# Altium project ZynqPi.PrjPcb (part 1 of 2)
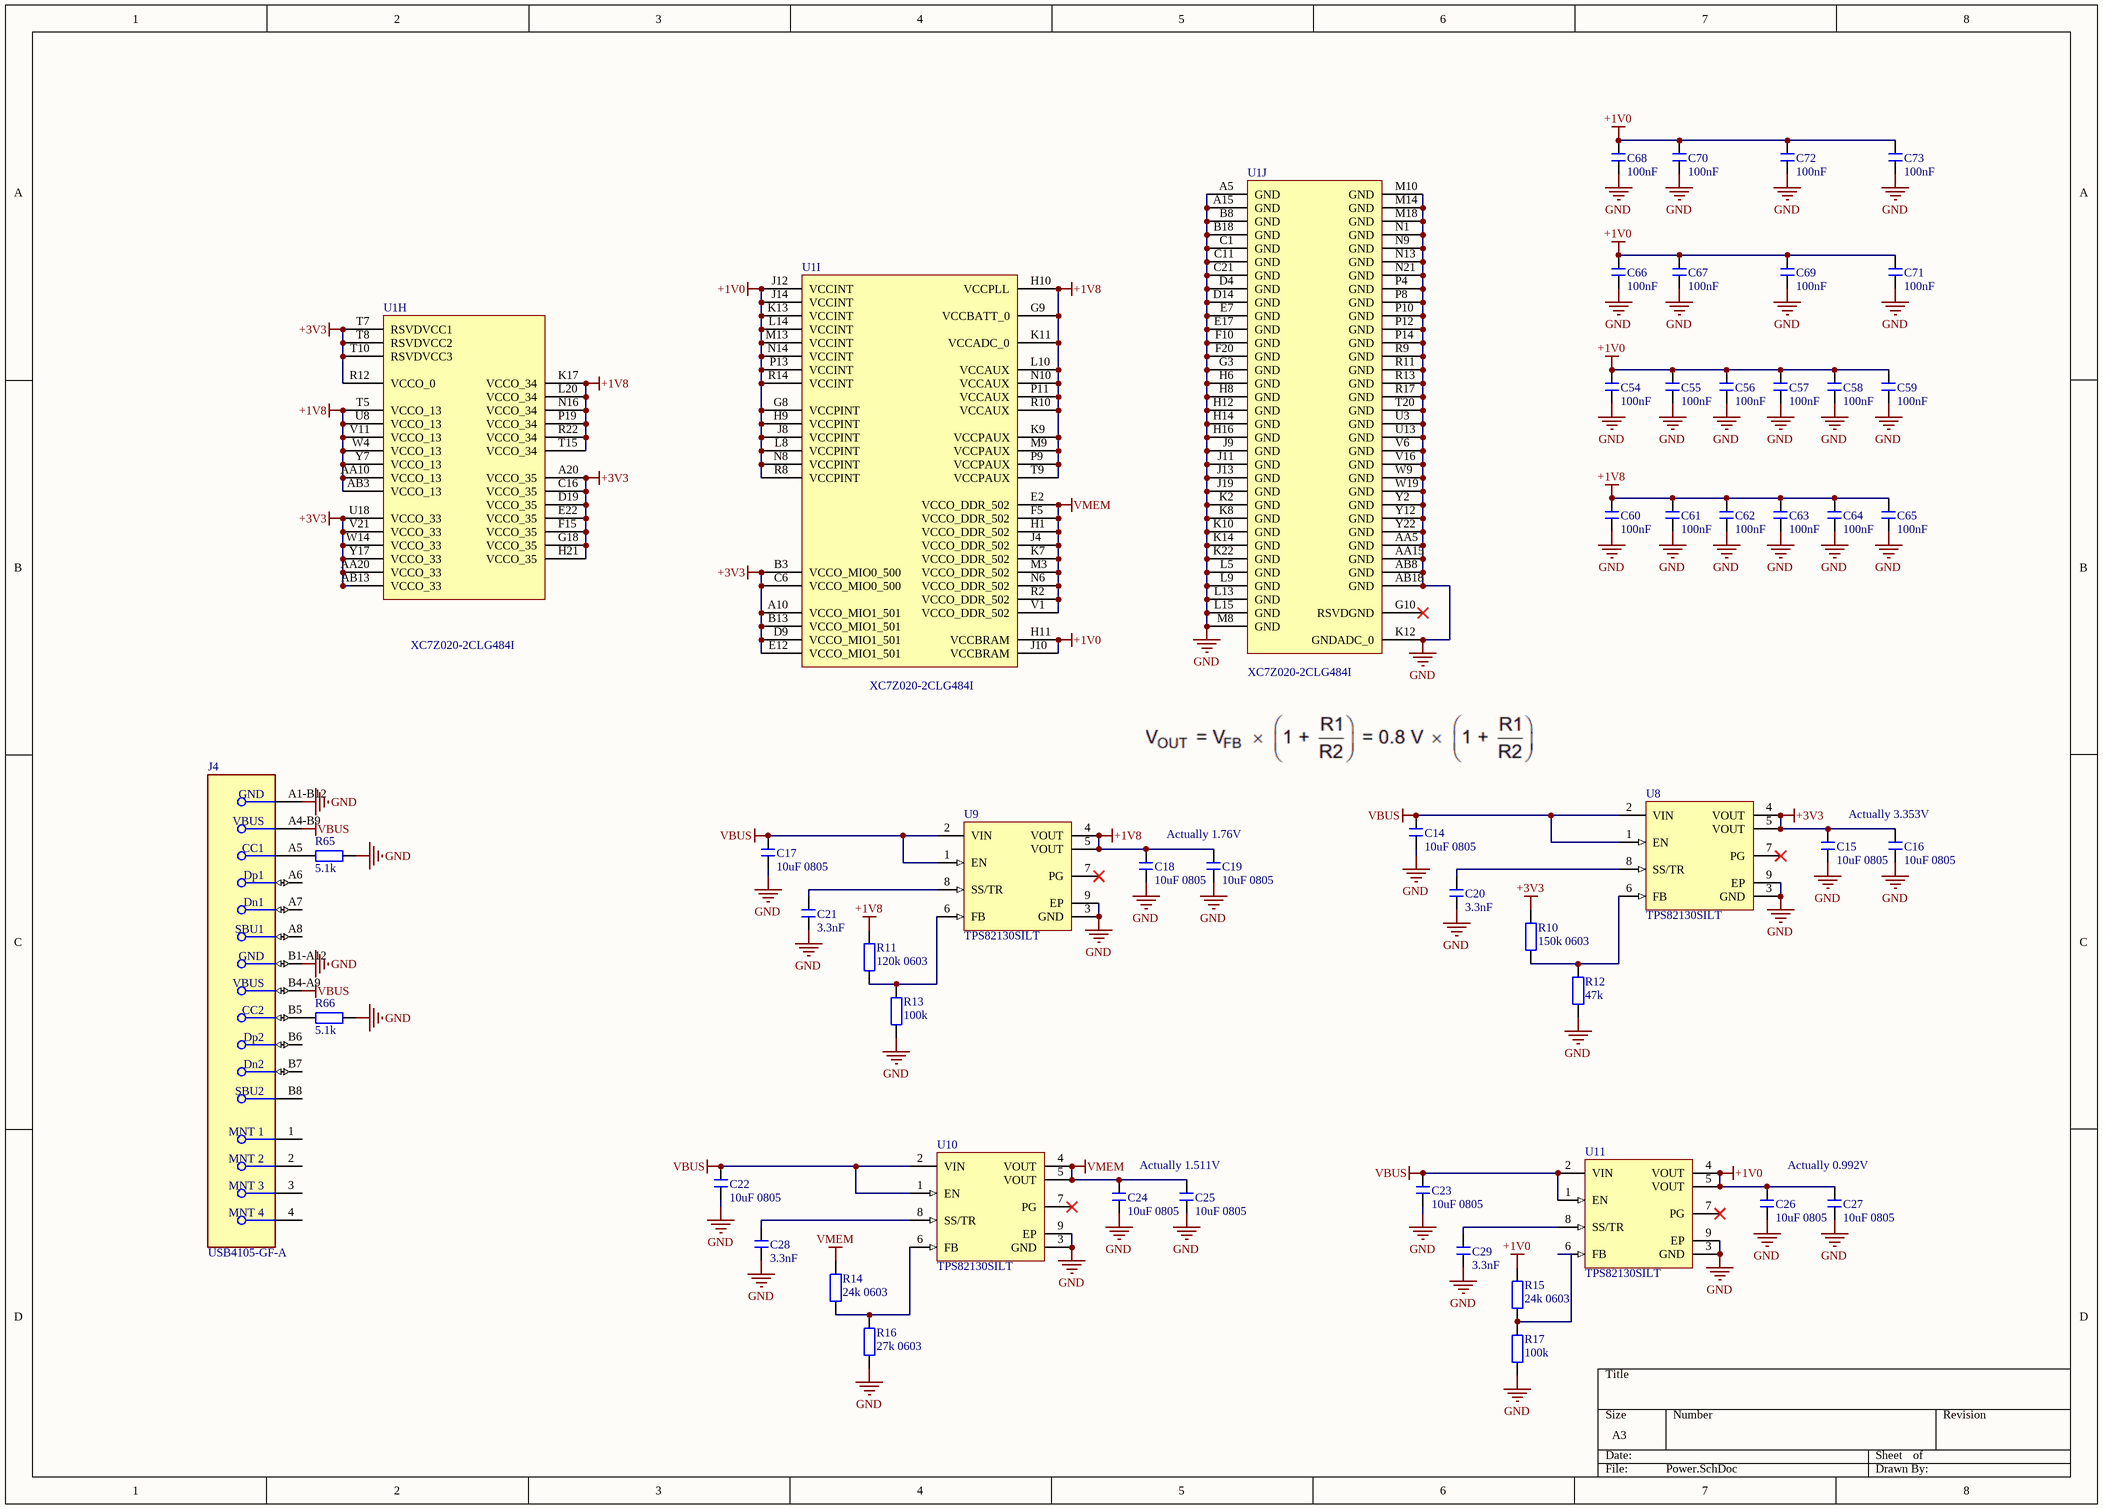
[diagram p0: Power.SchDoc]
9 sheets, 170 parts. Net scope: global (net labels, ports and power ports of the same name join across sheets).
Board file: PCB1.PcbDoc
Sheets:
  Sheet1.SchDoc
  Power.SchDoc
  DDR.SchDoc
  MIO.SchDoc
  Bank13.SchDoc
  Bank33.SchDoc
  Bank34.SchDoc
  Bank35.SchDoc
  Miscellaneous.SchDoc

## Sheet Sheet1.SchDoc
size A3; SheetNumber: 1; SheetTotal: 9

## Sheet Power.SchDoc
size A3; SheetNumber: 2; SheetTotal: 9

### Parts
C14  10uF 0805  [C0603]
C15  10uF 0805  [C0603]
C16  10uF 0805  [C0603]
C17  10uF 0805  [C0603]
C18  10uF 0805  [C0603]
C19  10uF 0805  [C0603]
C20  3.3nF  [C0402]
C21  3.3nF  [C0402]
C22  10uF 0805  [C0603]
C23  10uF 0805  [C0603]
C24  10uF 0805  [C0603]
C25  10uF 0805  [C0603]
C26  10uF 0805  [C0603]
C27  10uF 0805  [C0603]
C28  3.3nF  [C0402]
C29  3.3nF  [C0402]
C54  100nF  [C0402]
C55  100nF  [C0402]
C56  100nF  [C0402]
C57  100nF  [C0402]
C58  100nF  [C0402]
C59  100nF  [C0402]
C60  100nF  [C0402]
C61  100nF  [C0402]
C62  100nF  [C0402]
C63  100nF  [C0402]
C64  100nF  [C0402]
C65  100nF  [C0402]
C66  100nF  [C0402]
C67  100nF  [C0402]
C68  100nF  [C0402]
C69  100nF  [C0402]
C70  100nF  [C0402]
C71  100nF  [C0402]
C72  100nF  [C0402]
C73  100nF  [C0402]
J4  USB4105-GF-A  [FP-USB4105-GF-A-MFG]
R10  150k 0603  [R0603]
R11  120k 0603  [R0603]
R12  47k  [R0402]
R13  100k  [R0402]
R14  24k 0603  [R0603]
R15  24k 0603  [R0603]
R16  27k 0603  [R0603]
R17  100k  [R0402]
R65  5.1k  [R0402]
R66  5.1k  [R0402]
U1  XC7Z020-2CLG484I  [CLG484]  (parts H,I,J of 10)
U8  TPS82130SILT  [SIL0008D_V]
U9  TPS82130SILT  [SIL0008D_V]
U10  TPS82130SILT  [SIL0008D_V]
U11  TPS82130SILT  [SIL0008D_V]

### Nets
+1V0: C26.2 C27.2 C54.2 C55.2 C56.2 C57.2 C58.2 C59.2 C66.2 C67.2 C68.2 C69.2 C70.2 C71.2 C72.2 C73.2 R15.1 U1.G8(VCCPINT) U1.H9(VCCPINT) U1.H11(VCCBRAM) U1.J8(VCCPINT) U1.J10(VCCBRAM) U1.J12(VCCINT) U1.J14(VCCINT) U1.K13(VCCINT) U1.L8(VCCPINT) U1.L14(VCCINT) U1.M13(VCCINT) U1.N8(VCCPINT) U1.N14(VCCINT) U1.P13(VCCINT) U1.R8(VCCPINT) U1.R14(VCCINT) U11.4(VOUT) U11.5(VOUT)
+1V8: C18.2 C19.2 C60.2 C61.2 C62.2 C63.2 C64.2 C65.2 R11.1 U1.AA10(VCCO_13) U1.AB3(VCCO_13) U1.G9(VCCBATT_0) U1.H10(VCCPLL) U1.K9(VCCPAUX) U1.K11(VCCADC_0) U1.K17(VCCO_34) U1.L10(VCCAUX) U1.L20(VCCO_34) U1.M9(VCCPAUX) U1.N10(VCCAUX) U1.N16(VCCO_34) U1.P9(VCCPAUX) U1.P11(VCCAUX) U1.P19(VCCO_34) U1.R10(VCCAUX) U1.R22(VCCO_34) U1.T5(VCCO_13) U1.T9(VCCPAUX) U1.T15(VCCO_34) U1.U8(VCCO_13) U1.V11(VCCO_13) U1.W4(VCCO_13) U1.Y7(VCCO_13) U9.4(VOUT) U9.5(VOUT)
+3V3: C15.2 C16.2 R10.1 U1.A10(VCCO_MIO1_501) U1.A20(VCCO_35) U1.AA20(VCCO_33) U1.AB13(VCCO_33) U1.B3(VCCO_MIO0_500) U1.B13(VCCO_MIO1_501) U1.C6(VCCO_MIO0_500) U1.C16(VCCO_35) U1.D9(VCCO_MIO1_501) U1.D19(VCCO_35) U1.E12(VCCO_MIO1_501) U1.E22(VCCO_35) U1.F15(VCCO_35) U1.G18(VCCO_35) U1.H21(VCCO_35) U1.R12(VCCO_0) U1.T7(RSVDVCC1) U1.T8(RSVDVCC2) U1.T10(RSVDVCC3) U1.U18(VCCO_33) U1.V21(VCCO_33) U1.W14(VCCO_33) U1.Y17(VCCO_33) U8.4(VOUT) U8.5(VOUT)
GND: C14.1 C15.1 C16.1 C17.1 C18.1 C19.1 C20.1 C21.1 C22.1 C23.1 C24.1 C25.1 C26.1 C27.1 C28.1 C29.1 C54.1 C55.1 C56.1 C57.1 C58.1 C59.1 C60.1 C61.1 C62.1 C63.1 C64.1 C65.1 C66.1 C67.1 C68.1 C69.1 C70.1 C71.1 C72.1 C73.1 J4.A1-B12(GND) J4.B1-A12(GND) R12.2 R13.2 R16.2 R17.2 R65.2 R66.2 U1.A5(GND) U1.A15(GND) U1.AA5(GND) U1.AA15(GND) U1.AB8(GND) U1.AB18(GND) U1.B8(GND) U1.B18(GND) U1.C1(GND) U1.C11(GND) U1.C21(GND) U1.D4(GND) U1.D14(GND) U1.E7(GND) U1.E17(GND) U1.F10(GND) U1.F20(GND) U1.G3(GND) U1.H6(GND) U1.H8(GND) U1.H12(GND) U1.H14(GND) U1.H16(GND) U1.J9(GND) U1.J11(GND) U1.J13(GND) U1.J19(GND) U1.K2(GND) U1.K8(GND) U1.K10(GND) U1.K12(GNDADC_0) U1.K14(GND) U1.K22(GND) U1.L5(GND) U1.L9(GND) U1.L13(GND) U1.L15(GND) U1.M8(GND) U1.M10(GND) U1.M14(GND) U1.M18(GND) U1.N1(GND) U1.N9(GND) U1.N13(GND) U1.N21(GND) U1.P4(GND) U1.P8(GND) U1.P10(GND) U1.P12(GND) U1.P14(GND) U1.R9(GND) U1.R11(GND) U1.R13(GND) U1.R17(GND) U1.T20(GND) U1.U3(GND) U1.U13(GND) U1.V6(GND) U1.V16(GND) U1.W9(GND) U1.W19(GND) U1.Y2(GND) U1.Y12(GND) U1.Y22(GND) U8.3(GND) U8.9(EP) U9.3(GND) U9.9(EP) U10.3(GND) U10.9(EP) U11.3(GND) U11.9(EP)
VBUS: C14.2 C17.2 C22.2 C23.2 J4.A4-B9(VBUS) J4.B4-A9(VBUS) U8.1(EN) U8.2(VIN) U9.1(EN) U9.2(VIN) U10.1(EN) U10.2(VIN) U11.1(EN) U11.2(VIN)
VMEM: C24.2 C25.2 R14.1 U1.E2(VCCO_DDR_502) U1.F5(VCCO_DDR_502) U1.H1(VCCO_DDR_502) U1.J4(VCCO_DDR_502) U1.K7(VCCO_DDR_502) U1.M3(VCCO_DDR_502) U1.N6(VCCO_DDR_502) U1.R2(VCCO_DDR_502) U1.V1(VCCO_DDR_502) U10.4(VOUT) U10.5(VOUT)
NetC20_2: C20.2 U8.8(SS/TR)
NetC21_2: C21.2 U9.8(SS/TR)
NetC28_2: C28.2 U10.8(SS/TR)
NetC29_2: C29.2 U11.8(SS/TR)
NetJ4_A5: J4.A5(CC1) R65.1
NetJ4_B5: J4.B5(CC2) R66.1
NetR10_2: R10.2 R12.1 U8.6(FB)
NetR11_2: R11.2 R13.1 U9.6(FB)
NetR14_2: R14.2 R16.1 U10.6(FB)
NetR15_2: R15.2 R17.1 U11.6(FB)

Not connected (* = marked no-connect by the designer): J4 1(MNT_1) 2(MNT_2) 3(MNT_3) 4(MNT_4) A6(Dp1) A7(Dn1) A8(SBU1) B6(Dp2) B7(Dn2) B8(SBU2); U1 G10(RSVDGND)*; U8 7(PG)*; U9 7(PG)*; U10 7(PG)*; U11 7(PG)*

### Notes on the sheet
- Actually 1.76V
- Actually 3.353V
- Actually 1.511V
- Actually 0.992V

### Library data of the parts
C14-C29 C54-C73 = C
J4 = CMP-245163-000001-1: CONN RCPT USB2.0 TYPEC 5A; Manufacturer: GCT; Voltage Rating: 20V; Is Female: yes; Current Rating: 5/6.25/1.25/0.25A; Number Of Contacts: 16; Conn Orientation: Right Angle; Device Class L1: Connectors; Category: Conn; Lead Free: Yes; RoHS: TRUE; Temperature Range High: +85°C; Digikey Description: CONN RCPT USB2.0 TYPEC 5A; Device Class L3: unset; ComponentLink2Description: Datasheet; Manufacturer Part Number: USB4105-GF-A; Package: 0; Usb Standard: USB 2.0; Device Class L2: USB Connectors; Automotive: No; Temperature Range Low: -40°C; Height: 3.46mm; Temperature: -40°C to +85°C; Contact Material: Gold,Nickel; ComponentLink2URL: https://gct.co/files/drawings/usb4105.pdf; Octopart: https://octopart.com/usb4105-gf-a-gct-106627878
R10-R17 R65 R66 = R
U1 = CMP-0363-00013-3: 733 MHz Zynq™-7000 AP SoC, 130 PS I/O, 200 FPGA I/O, 484-Ball BGA, Speed Grade 2, Industrial Grade, Pb-Free; Speed Grade: -2; Flip Flops: 106400; LUTs: 53200; Extensible Block RAM (# 36Kb Blocks): 560 KB (140); ComponentLink3URL: http://www.xilinx.com/support/documentation/data_sheets/ds187-XC7Z010-XC7Z020-Data-Sheet.pdf; PackageReference: CLG484; Code_JEDEC: MO-275-PPAA-2; ComponentLink2URL: http://www.xilinx.com/support/documentation/user_guides/ug865-Zynq-7000-Pkg-Pinout.pdf; ComponentLink2Description: Package Specification; ComponentLink6URL: http://www.xilinx.com/support/documentation/user_guides/ug483_7Series_PCB.pdf; PackageVersion: Rev 1.1, 09/2012; DatasheetVersion: v1.2; PartNumber: XC7Z020-2CLG484I; ComponentLink3Description: DC and AC Switching Characteristics; PackageDescription: Wire-Bond Chip-Scale BGA, Body 19 x 19 mm, 0.8 mm Pitch; RoHS: Pb-Free; ComponentLink5URL: http://www.xilinx.com/support/documentation/user_guides/ug865-Zynq-7000-Pkg-Pinout.pdf; ComponentLink1URL: http://www.xilinx.com/support/documentation/data_sheets/ds190-Zynq-7000-Overview.pdf; ComponentLink4Description: Package File; Generic Part Number: XC7Z020; Mounting Technology: Surface Mount; ComponentLink1Description: Datasheet; ComponentLink4URL: http://www.xilinx.com/support/packagefiles/z7packages/xc7z020clg484pkg.txt; ComponentLink6Description: PCB and Layout Guide; ComponentLink5Description: Packaging and Pinout
U8-U11 = CMP-2000-07569-1: Step-Down Converter MicroSiP(TM) Module with Integrated Inductor, 3 A, 3 to 17 V, -40 to 125 degC, 8-Pin uSiP (SIL), Tape and Reel; Manufacturer: Texas Instruments; Quiescent Current: 20uA; Output Voltage: 5V; Output Current: 3A; Max Input Voltage: 17V; Switching Frequency: 2MHz; Min Output Voltage: 900mV; Number of Outputs: 1; Min Input Voltage: 3V; Datasheet URL: http://www.ti.com/lit/ds/symlink/tps82130.pdf; Packaging: CutTape; Datasheet Version: Rev. C, 01/2017; Package Reference: SIL0008D; Case/Package: SMD/SMT; Manufacturer URL: http://www.ti.com/; Length: 0.12inch; Lead Free: LeadFree; Mount: SurfaceMount; Number of Pins: 8; Package Description: 8-Pin Single In-line Package, Body 3 x 2.8 mm, Pitch 0.65 mm; Max Output Voltage: 5V; Mounting Technology: SurfaceMount; Height: 0.06inch; Max Operating Temperature: 125degC; Width: 0.11inch; Min Operating Temperature: -40degC; Voltage - Output 1: 5V; RoHSCompliant: True; REACH SVHC: NoSVHC; Max Output Current: 3A

## Sheet DDR.SchDoc
size A3; SheetNumber: 3; SheetTotal: 9
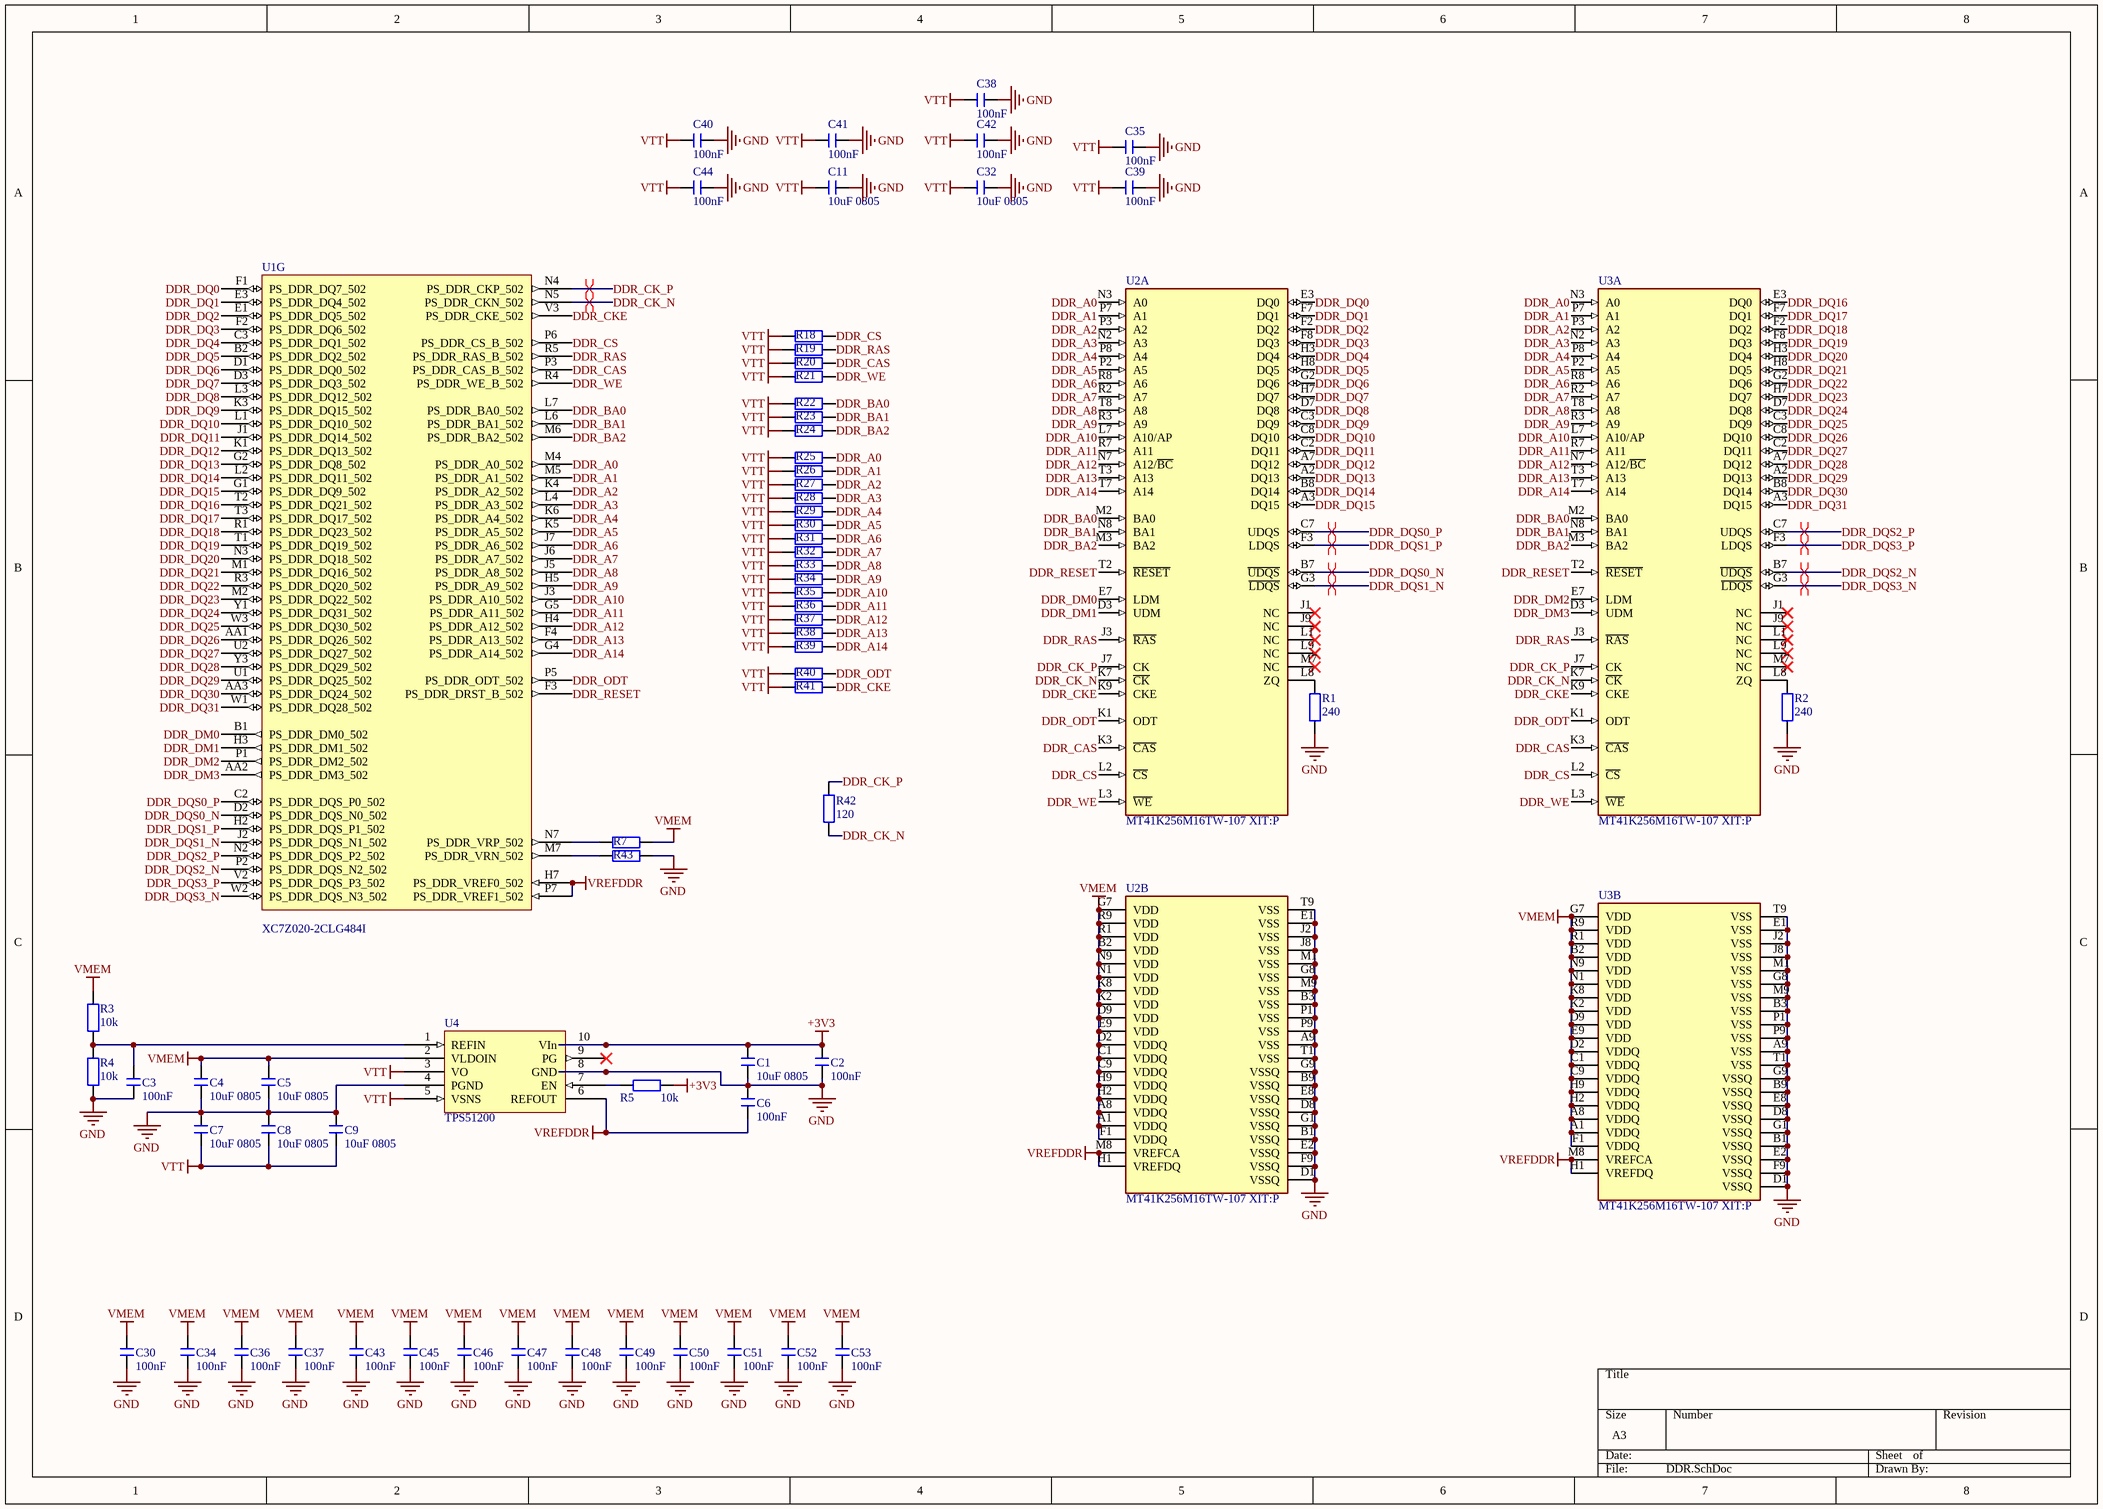
[diagram p1: DDR.SchDoc]

### Parts
C1  10uF 0805  [C0603]
C2  100nF  [C0402]
C3  100nF  [C0402]
C4  10uF 0805  [C0603]
C5  10uF 0805  [C0603]
C6  100nF  [C0402]
C7  10uF 0805  [C0603]
C8  10uF 0805  [C0603]
C9  10uF 0805  [C0603]
C11  10uF 0805  [C0603]
C30  100nF  [C0402]
C32  10uF 0805  [C0603]
C34  100nF  [C0402]
C35  100nF  [C0402]
C36  100nF  [C0402]
C37  100nF  [C0402]
C38  100nF  [C0402]
C39  100nF  [C0402]
C40  100nF  [C0402]
C41  100nF  [C0402]
C42  100nF  [C0402]
C43  100nF  [C0402]
C44  100nF  [C0402]
C45  100nF  [C0402]
C46  100nF  [C0402]
C47  100nF  [C0402]
C48  100nF  [C0402]
C49  100nF  [C0402]
C50  100nF  [C0402]
C51  100nF  [C0402]
C52  100nF  [C0402]
C53  100nF  [C0402]
R1  240  [R0402]
R2  240  [R0402]
R3  10k  [R0402]
R4  10k  [R0402]
R5  10k  [R0402]
R7  49.9  [R0402]  (value not drawn)
R18  49.9  [R0402]  (value not drawn)
R19  49.9  [R0402]  (value not drawn)
R20  49.9  [R0402]  (value not drawn)
R21  49.9  [R0402]  (value not drawn)
R22  49.9  [R0402]  (value not drawn)
R23  49.9  [R0402]  (value not drawn)
R24  49.9  [R0402]  (value not drawn)
R25  49.9  [R0402]  (value not drawn)
R26  49.9  [R0402]  (value not drawn)
R27  49.9  [R0402]  (value not drawn)
R28  49.9  [R0402]  (value not drawn)
R29  49.9  [R0402]  (value not drawn)
R30  49.9  [R0402]  (value not drawn)
R31  49.9  [R0402]  (value not drawn)
R32  49.9  [R0402]  (value not drawn)
R33  49.9  [R0402]  (value not drawn)
R34  49.9  [R0402]  (value not drawn)
R35  49.9  [R0402]  (value not drawn)
R36  49.9  [R0402]  (value not drawn)
R37  49.9  [R0402]  (value not drawn)
R38  49.9  [R0402]  (value not drawn)
R39  49.9  [R0402]  (value not drawn)
R40  49.9  [R0402]  (value not drawn)
R41  49.9  [R0402]  (value not drawn)
R42  120  [R0402]
R43  49.9  [R0402]  (value not drawn)
U1  XC7Z020-2CLG484I  [CLG484]  (part G of 10)
U2  MT41K256M16TW-107 XIT:P  [FP-TW-MFG]  (parts A,B of 2)
U3  MT41K256M16TW-107 XIT:P  [FP-TW-MFG]  (parts A,B of 2)
U4  TPS51200  [SON50P300X100_HS-11N]

### Nets
+3V3: C1.2 C2.2 R5.2 U4.10(VIn)
GND: C1.1 C2.1 C3.1 C4.1 C5.1 C6.2 C7.2 C8.2 C9.2 C11.1 C30.1 C32.1 C34.1 C35.1 C36.1 C37.1 C38.1 C39.1 C40.1 C41.1 C42.1 C43.1 C44.1 C45.1 C46.1 C47.1 C48.1 C49.1 C50.1 C51.1 C52.1 C53.1 R1.2 R2.2 R4.2 R43.2 U2.A9(VSS) U2.B1(VSSQ) U2.B3(VSS) U2.B9(VSSQ) U2.D1(VSSQ) U2.D8(VSSQ) U2.E1(VSS) U2.E2(VSSQ) U2.E8(VSSQ) U2.F9(VSSQ) U2.G1(VSSQ) U2.G8(VSS) U2.G9(VSSQ) U2.J2(VSS) U2.J8(VSS) U2.M1(VSS) U2.M9(VSS) U2.P1(VSS) U2.P9(VSS) U2.T1(VSS) U2.T9(VSS) U3.A9(VSS) U3.B1(VSSQ) U3.B3(VSS) U3.B9(VSSQ) U3.D1(VSSQ) U3.D8(VSSQ) U3.E1(VSS) U3.E2(VSSQ) U3.E8(VSSQ) U3.F9(VSSQ) U3.G1(VSSQ) U3.G8(VSS) U3.G9(VSSQ) U3.J2(VSS) U3.J8(VSS) U3.M1(VSS) U3.M9(VSS) U3.P1(VSS) U3.P9(VSS) U3.T1(VSS) U3.T9(VSS) U4.4(PGND) U4.8(GND)
VMEM: C4.2 C5.2 C30.2 C34.2 C36.2 C37.2 C43.2 C45.2 C46.2 C47.2 C48.2 C49.2 C50.2 C51.2 C52.2 C53.2 R3.1 R7.2 U2.A1(VDDQ) U2.A8(VDDQ) U2.B2(VDD) U2.C1(VDDQ) U2.C9(VDDQ) U2.D2(VDDQ) U2.D9(VDD) U2.E9(VDD) U2.F1(VDDQ) U2.G7(VDD) U2.H2(VDDQ) U2.H9(VDDQ) U2.K2(VDD) U2.K8(VDD) U2.N1(VDD) U2.N9(VDD) U2.R1(VDD) U2.R9(VDD) U3.A1(VDDQ) U3.A8(VDDQ) U3.B2(VDD) U3.C1(VDDQ) U3.C9(VDDQ) U3.D2(VDDQ) U3.D9(VDD) U3.E9(VDD) U3.F1(VDDQ) U3.G7(VDD) U3.H2(VDDQ) U3.H9(VDDQ) U3.K2(VDD) U3.K8(VDD) U3.N1(VDD) U3.N9(VDD) U3.R1(VDD) U3.R9(VDD) U4.2(VLDOIN)
VREFDDR: C6.1 U1.H7(PS_DDR_VREF0_502) U1.P7(PS_DDR_VREF1_502) U2.H1(VREFDQ) U2.M8(VREFCA) U3.H1(VREFDQ) U3.M8(VREFCA) U4.6(REFOUT)
VTT: C7.1 C8.1 C9.1 C11.2 C32.2 C35.2 C38.2 C39.2 C40.2 C41.2 C42.2 C44.2 R18.1 R19.1 R20.1 R21.1 R22.1 R23.1 R24.1 R25.1 R26.1 R27.1 R28.1 R29.1 R30.1 R31.1 R32.1 R33.1 R34.1 R35.1 R36.1 R37.1 R38.1 R39.1 R40.1 R41.1 U4.3(VO) U4.5(VSNS)
DDR_A0: R25.2 U1.M4(PS_DDR_A0_502) U2.N3(A0) U3.N3(A0)
DDR_A1: R26.2 U1.M5(PS_DDR_A1_502) U2.P7(A1) U3.P7(A1)
DDR_A2: R27.2 U1.K4(PS_DDR_A2_502) U2.P3(A2) U3.P3(A2)
DDR_A3: R28.2 U1.L4(PS_DDR_A3_502) U2.N2(A3) U3.N2(A3)
DDR_A4: R29.2 U1.K6(PS_DDR_A4_502) U2.P8(A4) U3.P8(A4)
DDR_A5: R30.2 U1.K5(PS_DDR_A5_502) U2.P2(A5) U3.P2(A5)
DDR_A6: R31.2 U1.J7(PS_DDR_A6_502) U2.R8(A6) U3.R8(A6)
DDR_A7: R32.2 U1.J6(PS_DDR_A7_502) U2.R2(A7) U3.R2(A7)
DDR_A8: R33.2 U1.J5(PS_DDR_A8_502) U2.T8(A8) U3.T8(A8)
DDR_A9: R34.2 U1.H5(PS_DDR_A9_502) U2.R3(A9) U3.R3(A9)
DDR_A10: R35.2 U1.J3(PS_DDR_A10_502) U2.L7(A10/AP) U3.L7(A10/AP)
DDR_A11: R36.2 U1.G5(PS_DDR_A11_502) U2.R7(A11) U3.R7(A11)
DDR_A12: R37.2 U1.H4(PS_DDR_A12_502) U2.N7(A12/~{BC}) U3.N7(A12/~{BC})
DDR_A13: R38.2 U1.F4(PS_DDR_A13_502) U2.T3(A13) U3.T3(A13)
DDR_A14: R39.2 U1.G4(PS_DDR_A14_502) U2.T7(A14) U3.T7(A14)
DDR_BA0: R22.2 U1.L7(PS_DDR_BA0_502) U2.M2(BA0) U3.M2(BA0)
DDR_BA1: R23.2 U1.L6(PS_DDR_BA1_502) U2.N8(BA1) U3.N8(BA1)
DDR_BA2: R24.2 U1.M6(PS_DDR_BA2_502) U2.M3(BA2) U3.M3(BA2)
DDR_CAS: R20.2 U1.P3(PS_DDR_CAS_B_502) U2.K3(~{CAS}) U3.K3(~{CAS})
DDR_CK_N: R42.1 U1.N5(PS_DDR_CKN_502) U2.K7(~{CK}) U3.K7(~{CK})
DDR_CK_P: R42.2 U1.N4(PS_DDR_CKP_502) U2.J7(CK) U3.J7(CK)
DDR_CKE: R41.2 U1.V3(PS_DDR_CKE_502) U2.K9(CKE) U3.K9(CKE)
DDR_CS: R18.2 U1.P6(PS_DDR_CS_B_502) U2.L2(~{CS}) U3.L2(~{CS})
DDR_DM0: U1.B1(PS_DDR_DM0_502) U2.E7(LDM)
DDR_DM1: U1.H3(PS_DDR_DM1_502) U2.D3(UDM)
DDR_DM2: U1.P1(PS_DDR_DM2_502) U3.E7(LDM)
DDR_DM3: U1.AA2(PS_DDR_DM3_502) U3.D3(UDM)
DDR_DQ0: U1.F1(PS_DDR_DQ7_502) U2.E3(DQ0)
DDR_DQ1: U1.E3(PS_DDR_DQ4_502) U2.F7(DQ1)
DDR_DQ2: U1.E1(PS_DDR_DQ5_502) U2.F2(DQ2)
DDR_DQ3: U1.F2(PS_DDR_DQ6_502) U2.F8(DQ3)
DDR_DQ4: U1.C3(PS_DDR_DQ1_502) U2.H3(DQ4)
DDR_DQ5: U1.B2(PS_DDR_DQ2_502) U2.H8(DQ5)
DDR_DQ6: U1.D1(PS_DDR_DQ0_502) U2.G2(DQ6)
DDR_DQ7: U1.D3(PS_DDR_DQ3_502) U2.H7(DQ7)
DDR_DQ8: U1.L3(PS_DDR_DQ12_502) U2.D7(DQ8)
DDR_DQ9: U1.K3(PS_DDR_DQ15_502) U2.C3(DQ9)
DDR_DQ10: U1.L1(PS_DDR_DQ10_502) U2.C8(DQ10)
DDR_DQ11: U1.J1(PS_DDR_DQ14_502) U2.C2(DQ11)
DDR_DQ12: U1.K1(PS_DDR_DQ13_502) U2.A7(DQ12)
DDR_DQ13: U1.G2(PS_DDR_DQ8_502) U2.A2(DQ13)
DDR_DQ14: U1.L2(PS_DDR_DQ11_502) U2.B8(DQ14)
DDR_DQ15: U1.G1(PS_DDR_DQ9_502) U2.A3(DQ15)
DDR_DQ16: U1.T2(PS_DDR_DQ21_502) U3.E3(DQ0)
DDR_DQ17: U1.T3(PS_DDR_DQ17_502) U3.F7(DQ1)
DDR_DQ18: U1.R1(PS_DDR_DQ23_502) U3.F2(DQ2)
DDR_DQ19: U1.T1(PS_DDR_DQ19_502) U3.F8(DQ3)
DDR_DQ20: U1.N3(PS_DDR_DQ18_502) U3.H3(DQ4)
DDR_DQ21: U1.M1(PS_DDR_DQ16_502) U3.H8(DQ5)
DDR_DQ22: U1.R3(PS_DDR_DQ20_502) U3.G2(DQ6)
DDR_DQ23: U1.M2(PS_DDR_DQ22_502) U3.H7(DQ7)
DDR_DQ24: U1.Y1(PS_DDR_DQ31_502) U3.D7(DQ8)
DDR_DQ25: U1.W3(PS_DDR_DQ30_502) U3.C3(DQ9)
DDR_DQ26: U1.AA1(PS_DDR_DQ26_502) U3.C8(DQ10)
DDR_DQ27: U1.U2(PS_DDR_DQ27_502) U3.C2(DQ11)
DDR_DQ28: U1.Y3(PS_DDR_DQ29_502) U3.A7(DQ12)
DDR_DQ29: U1.U1(PS_DDR_DQ25_502) U3.A2(DQ13)
DDR_DQ30: U1.AA3(PS_DDR_DQ24_502) U3.B8(DQ14)
DDR_DQ31: U1.W1(PS_DDR_DQ28_502) U3.A3(DQ15)
DDR_DQS0_N: U1.D2(PS_DDR_DQS_N0_502) U2.B7(~{UDQS})
DDR_DQS0_P: U1.C2(PS_DDR_DQS_P0_502) U2.C7(UDQS)
DDR_DQS1_N: U1.J2(PS_DDR_DQS_N1_502) U2.G3(~{LDQS})
DDR_DQS1_P: U1.H2(PS_DDR_DQS_P1_502) U2.F3(LDQS)
DDR_DQS2_N: U1.P2(PS_DDR_DQS_N2_502) U3.B7(~{UDQS})
DDR_DQS2_P: U1.N2(PS_DDR_DQS_P2_502) U3.C7(UDQS)
DDR_DQS3_N: U1.W2(PS_DDR_DQS_N3_502) U3.G3(~{LDQS})
DDR_DQS3_P: U1.V2(PS_DDR_DQS_P3_502) U3.F3(LDQS)
DDR_ODT: R40.2 U1.P5(PS_DDR_ODT_502) U2.K1(ODT) U3.K1(ODT)
DDR_RAS: R19.2 U1.R5(PS_DDR_RAS_B_502) U2.J3(~{RAS}) U3.J3(~{RAS})
DDR_RESET: U1.F3(PS_DDR_DRST_B_502) U2.T2(~{RESET}) U3.T2(~{RESET})
DDR_WE: R21.2 U1.R4(PS_DDR_WE_B_502) U2.L3(~{WE}) U3.L3(~{WE})
NetC3_2: C3.2 R3.2 R4.1 U4.1(REFIN)
NetR1_1: R1.1 U2.L8(ZQ)
NetR2_1: R2.1 U3.L8(ZQ)
NetR5_1: R5.1 U4.7(EN)
NetR7_1: R7.1 U1.N7(PS_DDR_VRP_502)
NetR43_1: R43.1 U1.M7(PS_DDR_VRN_502)

Not connected (* = marked no-connect by the designer): U2 J1(NC)* J9(NC)* L1(NC)* L9(NC)* M7(NC)*; U3 J1(NC)* J9(NC)* L1(NC)* L9(NC)* M7(NC)*; U4 9(PG)*

### Layout directives
differential pair: DDR_CK_N, DDR_CK_P, DDR_DQS0_N, DDR_DQS0_P, DDR_DQS1_N, DDR_DQS1_P, DDR_DQS2_N, DDR_DQS2_P, DDR_DQS3_N, DDR_DQS3_P

### Library data of the parts
C1-C9 C11 C30 C32 C34-C53 = C
R1-R5 R7 R18-R43 = R
U1 = CMP-0363-00013-3: 733 MHz Zynq™-7000 AP SoC, 130 PS I/O, 200 FPGA I/O, 484-Ball BGA, Speed Grade 2, Industrial Grade, Pb-Free; Speed Grade: -2; Flip Flops: 106400; LUTs: 53200; Extensible Block RAM (# 36Kb Blocks): 560 KB (140); Rule: UNIONINDEX=0|RULEKIND=SignalStimulus|NETSCOPE=AnyNet|LAYERKIND=SameLayer|NAME=Schematic Signal Stimulus|KIND=2|LEVEL=0|STARTTIME=1.000m|STOPTIME=9.000m|PERIODTIME=10.00m|UNIT=Imperial; Rule: UNIONINDEX=0|RULEKIND=SupplyNets|NETSCOPE=AnyNet|LAYERKIND=SameLayer|NAME=Schematic Supply Nets|VOLTAGE=1.500|UNIT=Imperial; ComponentLink3URL: http://www.xilinx.com/support/documentation/data_sheets/ds187-XC7Z010-XC7Z020-Data-Sheet.pdf; PackageReference: CLG484; Code_JEDEC: MO-275-PPAA-2; ComponentLink2URL: http://www.xilinx.com/support/documentation/user_guides/ug865-Zynq-7000-Pkg-Pinout.pdf; ComponentLink2Description: Package Specification; ComponentLink6URL: http://www.xilinx.com/support/documentation/user_guides/ug483_7Series_PCB.pdf; PackageVersion: Rev 1.1, 09/2012; DatasheetVersion: v1.2; PartNumber: XC7Z020-2CLG484I; ComponentLink3Description: DC and AC Switching Characteristics; PackageDescription: Wire-Bond Chip-Scale BGA, Body 19 x 19 mm, 0.8 mm Pitch; RoHS: Pb-Free; ComponentLink5URL: http://www.xilinx.com/support/documentation/user_guides/ug865-Zynq-7000-Pkg-Pinout.pdf; ComponentLink1URL: http://www.xilinx.com/support/documentation/data_sheets/ds190-Zynq-7000-Overview.pdf; ComponentLink4Description: Package File; Generic Part Number: XC7Z020; Mounting Technology: Surface Mount; ComponentLink1Description: Datasheet; ComponentLink4URL: http://www.xilinx.com/support/packagefiles/z7packages/xc7z020clg484pkg.txt; ComponentLink6Description: PCB and Layout Guide; ComponentLink5Description: Packaging and Pinout
U2 U3 = CMP-2000-07474-2: IC DRAM 4GBIT PARALLEL 96FBGA
U4 = TPS51200: Sink and Source DDR Termination Regulator

## Sheet MIO.SchDoc
size A3; SheetNumber: 4; SheetTotal: 9
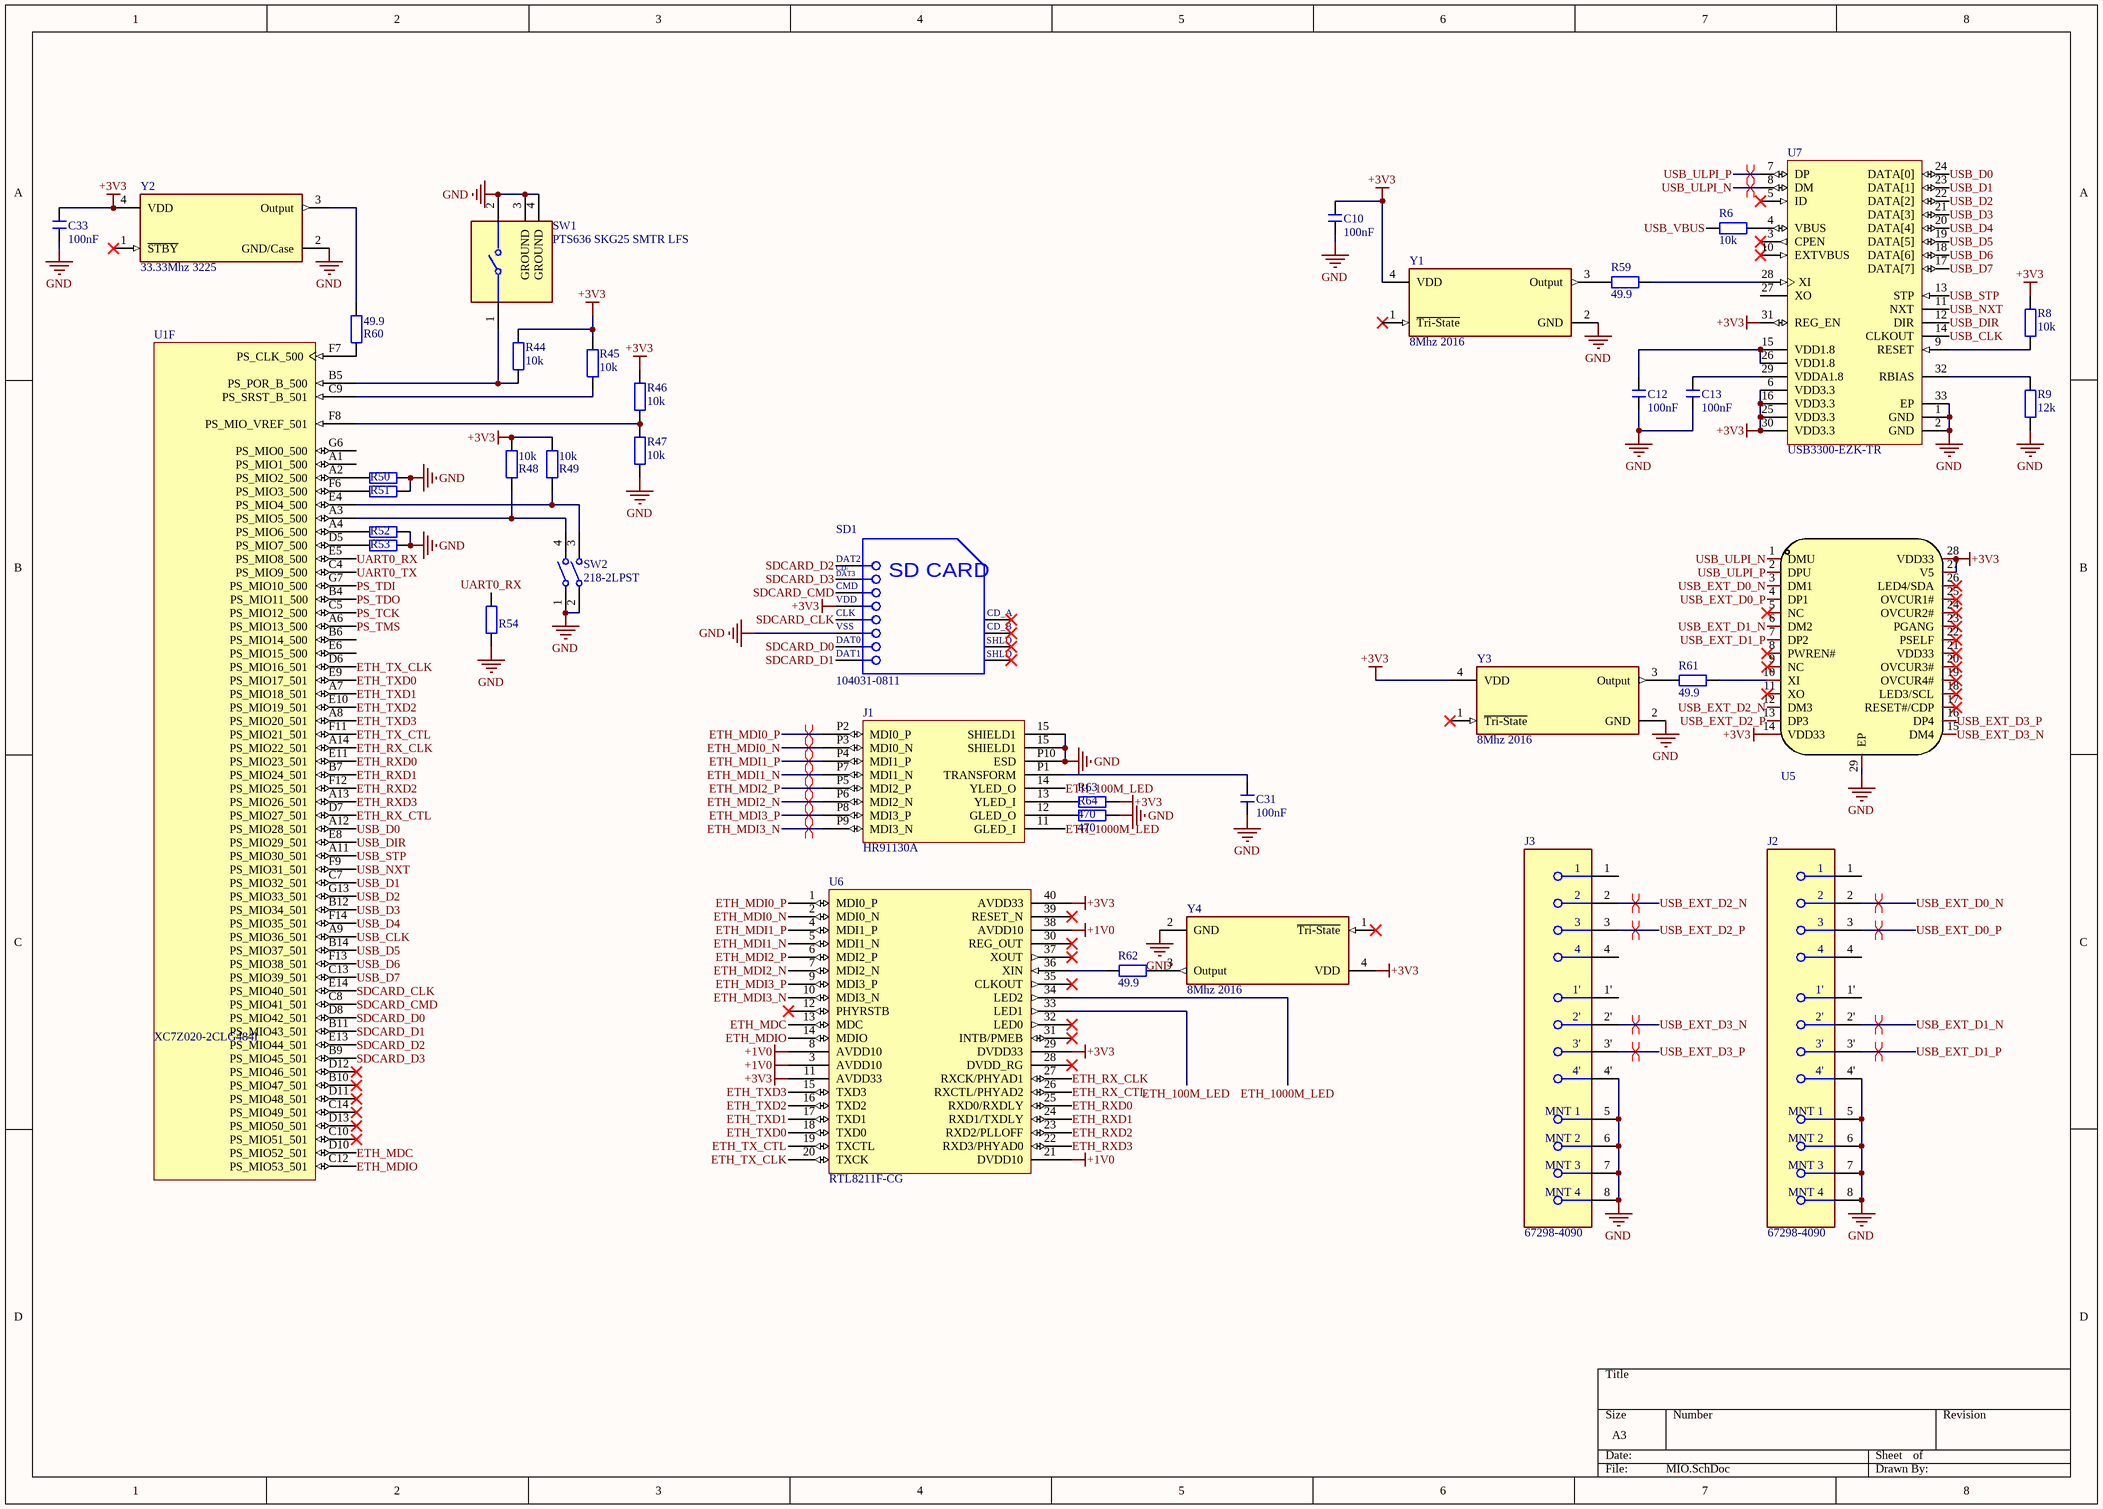
[diagram p2: MIO.SchDoc]

### Parts
C10  100nF  [C0402]
C12  100nF  [C0402]
C13  100nF  [C0402]
C31  100nF  [C0402]
C33  100nF  [C0402]
J1  HR91130A  [RJ45-TH_HR911130A]
J2  67298-4090  [FP-67298-4090-MFG]
J3  67298-4090  [FP-67298-4090-MFG]
R6  10k  [R0402]
R8  10k  [R0402]
R9  12k  [R0402]
R44  10k  [R0402]
R45  10k  [R0402]
R46  10k  [R0402]
R47  10k  [R0402]
R48  10k  [R0402]
R49  10k  [R0402]
R50  10k  [R0402]  (value not drawn)
R51  10k  [R0402]  (value not drawn)
R52  10k  [R0402]  (value not drawn)
R53  10k  [R0402]  (value not drawn)
R54  10k  [R0402]  (value not drawn)
R59  49.9  [R0402]
R60  49.9  [R0402]
R61  49.9  [R0402]
R62  49.9  [R0402]
R63  470  [R0402]
R64  470  [R0402]
SD1  104031-0811  [MOLX-104031-0811_V]
SW1  PTS636 SKG25 SMTR LFS  [FP-PTS636_SKG25_SMTR_LFS-MFG]
SW2  218-2LPST  [CTS-218-2LPST_V]
U1  XC7Z020-2CLG484I  [CLG484]  (part F of 10)
U5  CH334H  [QFN-28_L5.0-W5.0-P0.50-BL-EP]  (value not drawn)
U6  RTL8211F-CG  [QFN40P500X500X90_HS-41N]
U7  USB3300-EZK-TR  [MCHP-QFN-32-5x5_V2]
Y1  8Mhz 2016  [FP-ASA-ASAK-MFG]
Y2  33.33Mhz 3225  [FP-ASE-MFG]
Y3  8Mhz 2016  [FP-ASA-ASAK-MFG]
Y4  8Mhz 2016  [FP-ASA-ASAK-MFG]

### Nets
+1V0: U6.3(AVDD10) U6.8(AVDD10) U6.21(DVDD10) U6.38(AVDD10)
+3V3: C10.1 C33.1 R8.2 R44.1 R45.1 R46.1 R48.2 R49.2 R63.2 SD1.4(VDD) U5.14(VDD33) U5.27(V5) U5.28(VDD33) U6.11(AVDD33) U6.29(DVDD33) U6.40(AVDD33) U7.6(VDD3.3) U7.16(VDD3.3) U7.25(VDD3.3) U7.30(VDD3.3) U7.31(REG_EN) Y1.4(VDD) Y2.4(VDD) Y3.4(VDD) Y4.4(VDD)
GND: C10.2 C12.2 C13.2 C31.2 C33.2 J1.15(SHIELD1) J1.P10(ESD) J2.4' J2.5(MNT_1) J2.6(MNT_2) J2.7(MNT_3) J2.8(MNT_4) J3.4' J3.5(MNT_1) J3.6(MNT_2) J3.7(MNT_3) J3.8(MNT_4) R9.1 R47.2 R50.2 R51.2 R52.2 R53.2 R54.2 R64.2 SD1.6(VSS2) SW1.2 SW1.3(GROUND) SW1.4(GROUND) SW2.1 SW2.2 U5.29(EP) U7.1(GND) U7.2(GND) U7.33(EP) Y1.2(GND) Y2.2(GND/Case) Y3.2(GND) Y4.2(GND)
ETH_100M_LED: J1.14(YLED_O) U6.33(LED1)
ETH_1000M_LED: J1.11(GLED_I) U6.34(LED2)
ETH_MDC: U1.D10(PS_MIO52_501) U6.13(MDC)
ETH_MDI0_N: J1.P3(MDI0_N) U6.2(MDI0_N)
ETH_MDI0_P: J1.P2(MDI0_P) U6.1(MDI0_P)
ETH_MDI1_N: J1.P7(MDI1_N) U6.5(MDI1_N)
ETH_MDI1_P: J1.P4(MDI1_P) U6.4(MDI1_P)
ETH_MDI2_N: J1.P6(MDI2_N) U6.7(MDI2_N)
ETH_MDI2_P: J1.P5(MDI2_P) U6.6(MDI2_P)
ETH_MDI3_N: J1.P9(MDI3_N) U6.10(MDI3_N)
ETH_MDI3_P: J1.P8(MDI3_P) U6.9(MDI3_P)
ETH_MDIO: U1.C12(PS_MIO53_501) U6.14(MDIO)
ETH_RX_CLK: U1.A14(PS_MIO22_501) U6.27(RXCK/PHYAD1)
ETH_RX_CTL: U1.D7(PS_MIO27_501) U6.26(RXCTL/PHYAD2)
ETH_RXD0: U1.E11(PS_MIO23_501) U6.25(RXD0/RXDLY)
ETH_RXD1: U1.B7(PS_MIO24_501) U6.24(RXD1/TXDLY)
ETH_RXD2: U1.F12(PS_MIO25_501) U6.23(RXD2/PLLOFF)
ETH_RXD3: U1.A13(PS_MIO26_501) U6.22(RXD3/PHYAD0)
ETH_TX_CLK: U1.D6(PS_MIO16_501) U6.20(TXCK)
ETH_TX_CTL: U1.F11(PS_MIO21_501) U6.19(TXCTL)
ETH_TXD0: U1.E9(PS_MIO17_501) U6.18(TXD0)
ETH_TXD1: U1.A7(PS_MIO18_501) U6.17(TXD1)
ETH_TXD2: U1.E10(PS_MIO19_501) U6.16(TXD2)
ETH_TXD3: U1.A8(PS_MIO20_501) U6.15(TXD3)
PS_TCK: U1.C5(PS_MIO12_500)
PS_TDI: U1.G7(PS_MIO10_500)
PS_TDO: U1.B4(PS_MIO11_500)
PS_TMS: U1.A6(PS_MIO13_500)
SDCARD_CLK: SD1.5(CLK) U1.E14(PS_MIO40_501)
SDCARD_CMD: SD1.3(VSS1) U1.C8(PS_MIO41_501)
SDCARD_D0: SD1.7(DAT0) U1.D8(PS_MIO42_501)
SDCARD_D1: SD1.8(DAT1) U1.B11(PS_MIO43_501)
SDCARD_D2: SD1.1(CD/DAT3) U1.E13(PS_MIO44_501)
SDCARD_D3: SD1.2(CMD) U1.B9(PS_MIO45_501)
UART0_RX: R54.1 U1.E5(PS_MIO8_500)
UART0_TX: U1.C4(PS_MIO9_500)
USB_CLK: U1.A9(PS_MIO36_501) U7.14(CLKOUT)
USB_D0: U1.A12(PS_MIO28_501) U7.24(DATA[0])
USB_D1: U1.C7(PS_MIO32_501) U7.23(DATA[1])
USB_D2: U1.G13(PS_MIO33_501) U7.22(DATA[2])
USB_D3: U1.B12(PS_MIO34_501) U7.21(DATA[3])
USB_D4: U1.F14(PS_MIO35_501) U7.20(DATA[4])
USB_D5: U1.B14(PS_MIO37_501) U7.19(DATA[5])
USB_D6: U1.F13(PS_MIO38_501) U7.18(DATA[6])
USB_D7: U1.C13(PS_MIO39_501) U7.17(DATA[7])
USB_DIR: U1.E8(PS_MIO29_501) U7.12(DIR)
USB_EXT_D0_N: J2.2 U5.3(DM1)
USB_EXT_D0_P: J2.3 U5.4(DP1)
USB_EXT_D1_N: J2.2' U5.6(DM2)
USB_EXT_D1_P: J2.3' U5.7(DP2)
USB_EXT_D2_N: J3.2 U5.12(DM3)
USB_EXT_D2_P: J3.3 U5.13(DP3)
USB_EXT_D3_N: J3.2' U5.15(DM4)
USB_EXT_D3_P: J3.3' U5.16(DP4)
USB_NXT: U1.F9(PS_MIO31_501) U7.11(NXT)
USB_STP: U1.A11(PS_MIO30_501) U7.13(STP)
USB_ULPI_N: U5.1(DMU) U7.8(DM)
USB_ULPI_P: U5.2(DPU) U7.7(DP)
USB_VBUS: R6.2
NetC12_1: C12.1 U7.15(VDD1.8) U7.26(VDD1.8)
NetC13_1: C13.1 U7.29(VDDA1.8)
NetC31_1: C31.1 J1.P1(TRANSFORM)
NetJ1_12: J1.12(GLED_O) R64.1
NetJ1_13: J1.13(YLED_I) R63.1
NetR6_1: R6.1 U7.4(VBUS)
NetR8_1: R8.1 U7.9(RESET)
NetR9_2: R9.2 U7.32(RBIAS)
NetR44_2: R44.2 SW1.1 U1.B5(PS_POR_B_500)
NetR45_2: R45.2 U1.C9(PS_SRST_B_501)
NetR46_2: R46.2 R47.1 U1.F8(PS_MIO_VREF_501)
NetR48_1: R48.1 SW2.4 U1.A3(PS_MIO5_500)
NetR49_1: R49.1 SW2.3 U1.E4(PS_MIO4_500)
NetR50_1: R50.1 U1.A2(PS_MIO2_500)
NetR51_1: R51.1 U1.F6(PS_MIO3_500)
NetR52_1: R52.1 U1.A4(PS_MIO6_500)
NetR53_1: R53.1 U1.D5(PS_MIO7_500)
NetR59_1: R59.1 U7.28(XI)
NetR59_2: R59.2 Y1.3(Output)
NetR60_1: R60.1 U1.F7(PS_CLK_500)
NetR60_2: R60.2 Y2.3(Output)
NetR61_1: R61.1 U5.10(XI)
NetR61_2: R61.2 Y3.3(Output)
NetR62_1: R62.1 Y4.3(Output)
NetR62_2: R62.2 U6.36(XIN)

Not connected (* = marked no-connect by the designer): J2 1 1' 4; J3 1 1' 4; SD1 9(CD_A)* 10(CD_B)* 11(SHLD1)* 12(SHLD2)*; U1 A1(PS_MIO1_500) B6(PS_MIO14_500) B10(PS_MIO47_501)* C10(PS_MIO51_501)* C14(PS_MIO49_501)* D11(PS_MIO48_501)* D12(PS_MIO46_501)* D13(PS_MIO50_501)* E6(PS_MIO15_500) G6(PS_MIO0_500); U5 5(NC)* 8(PWREN#)* 9(NC)* 11(XO)* 17(RESET#/CDP)* 18(LED3/SCL)* 19(OVCUR4#)* 20(OVCUR3#)* 21(VDD33)* 22(PSELF)* 23(PGANG)* 24(OVCUR2#)* 25(OVCUR1#)* 26(LED4/SDA)*; U6 12(PHYRSTB)* 28(DVDD_RG)* 30(REG_OUT)* 31(INTB/PMEB)* 32(LED0)* 35(CLKOUT)* 37(XOUT)* 39(RESET_N)*; U7 3(CPEN)* 5(ID)* 10(EXTVBUS)* 27(XO); Y1 1(~{Tri-State})*; Y2 1(~{STBY})*; Y3 1(~{Tri-State})*; Y4 1(~{Tri-State})*

### Layout directives
differential pair: ETH_MDI0_N, ETH_MDI0_P, ETH_MDI1_N, ETH_MDI1_P, ETH_MDI2_N, ETH_MDI2_P, ETH_MDI3_N, ETH_MDI3_P, USB_EXT_D0_N, USB_EXT_D0_P, USB_EXT_D1_N, USB_EXT_D1_P, USB_EXT_D2_N, USB_EXT_D2_P, USB_EXT_D3_N, USB_EXT_D3_P, USB_ULPI_N, USB_ULPI_P

### Notes on the sheet
- (in symbol CMP-2000-05825-1) DAT2; CD/; DAT3; SD CARD; VSS; SHLD

### Library data of the parts
C10 C12 C13 C31 C33 = C
J1 = HR91130A: 100/1000Base-T Magnetics Single Port RJ45 Connector with Intergarted Magnetics and LED
J2 J3 = CMP-00257-00314314-1: 67298-4090 Conn USB 2.0 Type A RCP 8 POS 2mm/2.5mm Solder RA Thru-Hole 8 Terminal 2 Port USB Tray; NexarPartId: 314314; Current Rating: 1.5A; Number of Ports: 2; USB Standard: USB 2.0; Connector Type: Receptacle, USB; Number of Circuits: 8; Voltage Rating (DC): 30V; Gender: Receptacle; Number of Terminals: 8; Orientation: Right Angle; Termination: Solder; Mount: Through Hole; Radiation Hardening: No; Max Operating Temperature: 50°C; Number of Rows: 2; Lead Pitch: 2.5mm; RoHS: Compliant; Voltage Rating: 30V; Length: 15.6mm; Number of Positions: 8; Housing Material: Polyester; Max Voltage Rating (DC): 30V; Contact Plating: Gold; Schedule B: 8536695050, 8536695050; Flammability Rating: UL94 V-0; Housing Color: White; REACH SVHC: Unknown; Lead Free: Lead Free; Min Operating Temperature: 0°C; Height: 16.12mm; Contact Material: Bronze, Gold, Nickel; Number of Contacts: 8
R6 R8 R9 R44-R54 R59-R64 = R
SD1 = CMP-2000-05825-1: Micro SD Card, RA, -25 to 85 degC, 8-Pin SMD, RoHS, Tape and Reel; Voltage Rating: 10VAC/DC; Number of Contacts: 8; Insertion - Extraction Style: Push-Pull; Pitch: 1.1mm; Mating Cycles: 10000; Brand: Molex; Current Rating: 500mA; Manufacturer URL: http://www.molex.com/; Card Type: microSD; Mounting Type: Standard; Height: 1.42mm; Mounting Technology: SurfaceMount; Contact Plating: Gold; Product Category: MemoryCardConnectors; Package Description: 8-Pin Surface Mount Device, Body 11.95 x 11.4 mm, Pitch 1.1 mm; Datasheet URL: http://www.molex.com/pdm_docs/sd/1040310811_sd.pdf; Termination Style: SMD; Length: 11.4mm; Housing Material: LiquidCrystalPolymer(LCP); Orientation: RightAngle; RoHS: True; Contact Material: PhosphorBronze; Datasheet Version: Rev. E, 04/2006; Packaging: Reel; Manufacturer: Molex; Series: 104031; Product: CardConnectors; Number of Rows: 1Row; Package Reference: 104031-0811
SW1 = CMP-10040-000025-1: TACT 6.0 X 3.5, 2.5 MM H, 250GF,
SW2 = CMP-2000-05530-1: Half Pitch DIP Switch Auto Placeable, 25 mA, 24 V, -55 to 85 degC, 4-Pin SMD, RoHS, Tube; Manufacturer: CTS Corporation; Voltage Rating: 24VDC; Number of Positions: 2; Online Catalog: 218Series; Actuator Type: Slide(Standard); Washable: Yes; Pitch: 0.050"(1.27mm),Half; 3D Model: 218Series2Pole.stp; Catalog Drawings: 218-2218SeriesFootprint218SeriesEnd; Other Names: 2182LPSTCT2182LPST; Electrical Life: 1,000Cycles; Current Rating: 25mA; Actuator Level: Flush,Recessed; Circuit: SPST; Package Reference: 218-2LPST; Contact Finish: Gold; Product Training Modules: DIPSwitch; Mounting Technology: SurfaceMount; Datasheet URL: http://www.ctscorp.com/wp-content/uploads/2015/11/218.pdf; Height Above Board: 0.104"(2.65mm); Operating Temperature: -55°C~85°C; Family: DIPSwitches; Package Description: 4-Pin Surface Mount Device, Body 5.8 x 3.71 mm, Pitch 1.27 mm; Packaging: Tube; Category: Switches; Features: EpoxySealedTerminals,TapeSeal; Series: 218; Mounting Type: SurfaceMount; Mechanical Life: -; Termination Style: GullWing; Length: 0.146"(3.71mm); Body Material: -; Standard Package: 145; Contact Material: BerylliumCopper; Manufacturer URL: http://www.ctscorp.com/; Datasheet Version: 12/2008
U1 = CMP-0363-00013-3: as U1 on sheet Power; ComponentLink3URL: http://www.xilinx.com/support/documentation/data_sheets/ds187-XC7Z010-XC7Z020-Data-Sheet.pdf; PackageReference: CLG484; Code_JEDEC: MO-275-PPAA-2; ComponentLink2URL: http://www.xilinx.com/support/documentation/user_guides/ug865-Zynq-7000-Pkg-Pinout.pdf; ComponentLink2Description: Package Specification; ComponentLink6URL: http://www.xilinx.com/support/documentation/user_guides/ug483_7Series_PCB.pdf; PackageVersion: Rev 1.1, 09/2012; DatasheetVersion: v1.2; PartNumber: XC7Z020-2CLG484I; ComponentLink3Description: DC and AC Switching Characteristics; PackageDescription: Wire-Bond Chip-Scale BGA, Body 19 x 19 mm, 0.8 mm Pitch; RoHS: Pb-Free; ComponentLink5URL: http://www.xilinx.com/support/documentation/user_guides/ug865-Zynq-7000-Pkg-Pinout.pdf; ComponentLink1URL: http://www.xilinx.com/support/documentation/data_sheets/ds190-Zynq-7000-Overview.pdf; ComponentLink4Description: Package File; Generic Part Number: XC7Z020; Mounting Technology: Surface Mount; ComponentLink1Description: Datasheet; ComponentLink4URL: http://www.xilinx.com/support/packagefiles/z7packages/xc7z020clg484pkg.txt; ComponentLink6Description: PCB and Layout Guide; ComponentLink5Description: Packaging and Pinout
U5 = CH334H: Manufacturer: WCH(南京沁恒); Add into BOM: yes; Name: CH334H; Symbol: CH334H; Device: CH334H; LCSC Part Name: CH334H; Supplier Part: C3034270; Manufacturer Part: CH334H; Supplier Footprint: QFN-28(5x5); JLCPCB Part Class: Extended Part; Datasheet: https://atta.szlcsc.com/upload/public/pdf/source/20220607/DC93EAF28D88731A801F418A8003FCFE.pdf; Supplier: LCSC; Convert to PCB: yes
U6 = RTL8211F-CG: INTEGRATED 10/100/1000M ETHERNET / PRECISION TRANSCEIVER
U7 = CMP-0186-00339-1: Hi-Speed USB Host, Device or OTG PHY with ULPI Low Pin Interface, 5 pF, -40 to 85 degC, 32-Pin QFN (QFN-3304), RoHS, Tape and Reel; CI: 5 pF; ComponentLink3URL: http://ww1.microchip.com/downloads/en/DeviceDoc/8710a.pdf; DatasheetVersion: DS00001783B; Code_JEDEC: MO-220; Mounting Technology: Surface Mount; ComponentLink2URL: http://ww1.microchip.com/downloads/en/DeviceDoc/00001783B.pdf; Temperature Min: -40 degC; Temperature Max: 85 degC; ComponentLink2Description: Datasheet; RoHS: TRUE; PackageVersion: Rev. H, 07/2004; Generic Part Number: USB3300; ComponentLink1URL: http://www.microchip.com/; PackageDescription: 32-Pin Quad Flat Non-Leaded Package, Body 5 x 5 mm, Pitch 0.5 mm; ComponentLink3Description: Package Specification; ComponentLink1Description: Manufacturer URL; Packing: Tape and Reel; PartNumber: USB3300-EZK-TR
Y1 Y3 Y4 = CMP-27762-001496-1: Crystal Oscillator 12.288MHz ±50ppm HCMOS 3.3V SMD 2x1.6mm; Min Supply Voltage: 2.97V; Max Supply Current: 5mA; Load Capacitance: 15pF; Max Supply Voltage: 3.66V; Series: ASA; Min Operating Temperature: -40°C; Height: 0.031inch; Packaging: Tape and Reel; Mount: Surface Mount; Operating Supply Voltage: 3.3V; Frequency Stability: 50ppm; Termination: SMD/SMT; Length: 0.079inch; Frequency: 12.288MHz; Max Operating Temperature: 85°C; Case/Package: SMD/SMT; Package Quantity: 3000; Width: 0.063inch
Y2 = CMP-27762-010648-1: XTAL Oscillator 33.333MHz ±50ppm CMOS 3.3V 4-SMD 3.2mm x 2.5mm; Max Supply Voltage: 3.465V; Min Supply Voltage: 3.135V; Max Supply Current: 13mA; Load Capacitance: 15pF; Series: ASE; Termination: SMD/SMT; Width: 0.098inch; Radiation Hardening: No; Operating Frequency: 33.333 MHz; Number of Pins: 4; Frequency Stability: 50ppm; Package Quantity: 1000; Frequency: 33.333MHz; Min Operating Temperature: -40°C; Height: 0.047inch; Length: 3.2mm; Case/Package: SMD/SMT; Lead Free: Lead Free; Mount: Surface Mount; Depth: 2.5mm; Max Operating Temperature: 85°C; Operating Supply Voltage: 3.3V; Packaging: Tape and Reel; REACH SVHC: No SVHC

## Sheet Bank13.SchDoc
size A3; SheetNumber: 5; SheetTotal: 9
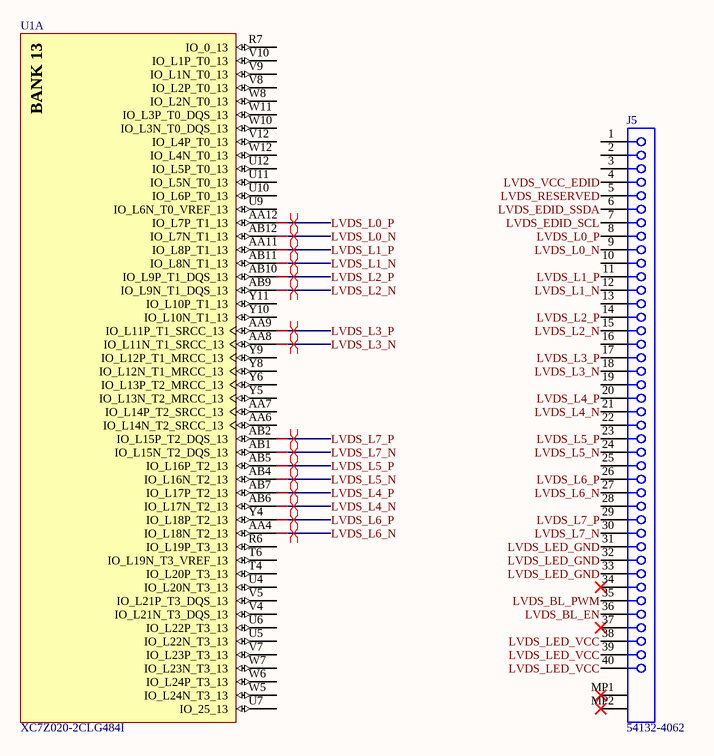
[diagram p3: Bank13.SchDoc]

### Parts
J5  54132-4062  [MOLX-54132-4062]
U1  XC7Z020-2CLG484I  [CLG484]  (part A of 10)

### Nets
LVDS_BL_EN: J5.36
LVDS_BL_PWM: J5.35
LVDS_EDID_SCL: J5.7
LVDS_EDID_SSDA: J5.6
LVDS_L0_N: J5.9 U1.AB12(IO_L7N_T1_13)
LVDS_L0_P: J5.8 U1.AA12(IO_L7P_T1_13)
LVDS_L1_N: J5.12 U1.AB11(IO_L8N_T1_13)
LVDS_L1_P: J5.11 U1.AA11(IO_L8P_T1_13)
LVDS_L2_N: J5.15 U1.AB9(IO_L9N_T1_DQS_13)
LVDS_L2_P: J5.14 U1.AB10(IO_L9P_T1_DQS_13)
LVDS_L3_N: J5.18 U1.AA8(IO_L11N_T1_SRCC_13)
LVDS_L3_P: J5.17 U1.AA9(IO_L11P_T1_SRCC_13)
LVDS_L4_N: J5.21 U1.AB6(IO_L17N_T2_13)
LVDS_L4_P: J5.20 U1.AB7(IO_L17P_T2_13)
LVDS_L5_N: J5.24 U1.AB4(IO_L16N_T2_13)
LVDS_L5_P: J5.23 U1.AB5(IO_L16P_T2_13)
LVDS_L6_N: J5.27 U1.AA4(IO_L18N_T2_13)
LVDS_L6_P: J5.26 U1.Y4(IO_L18P_T2_13)
LVDS_L7_N: J5.30 U1.AB1(IO_L15N_T2_DQS_13)
LVDS_L7_P: J5.29 U1.AB2(IO_L15P_T2_DQS_13)
LVDS_LED_GND: J5.31 J5.32 J5.33
LVDS_LED_VCC: J5.38 J5.39 J5.40
LVDS_RESERVED: J5.5
LVDS_VCC_EDID: J5.4

Not connected (* = marked no-connect by the designer): J5 1 2 3 10 13 16 19 22 25 28 34* 37* MP1* MP2*; U1 AA6(IO_L14N_T2_SRCC_13) AA7(IO_L14P_T2_SRCC_13) R6(IO_L19P_T3_13) R7(IO_0_13) T4(IO_L20P_T3_13) T6(IO_L19N_T3_VREF_13) U4(IO_L20N_T3_13) U5(IO_L22N_T3_13) U6(IO_L22P_T3_13) U7(IO_25_13) U9(IO_L6N_T0_VREF_13) U10(IO_L6P_T0_13) U11(IO_L5N_T0_13) U12(IO_L5P_T0_13) V4(IO_L21N_T3_DQS_13) V5(IO_L21P_T3_DQS_13) V7(IO_L23P_T3_13) V8(IO_L2P_T0_13) V9(IO_L1N_T0_13) V10(IO_L1P_T0_13) V12(IO_L4P_T0_13) W5(IO_L24N_T3_13) W6(IO_L24P_T3_13) W7(IO_L23N_T3_13) W8(IO_L2N_T0_13) W10(IO_L3N_T0_DQS_13) W11(IO_L3P_T0_DQS_13) W12(IO_L4N_T0_13) Y5(IO_L13N_T2_MRCC_13) Y6(IO_L13P_T2_MRCC_13) Y8(IO_L12N_T1_MRCC_13) Y9(IO_L12P_T1_MRCC_13) Y10(IO_L10N_T1_13) Y11(IO_L10P_T1_13)

### Layout directives
differential pair: LVDS_L0_N, LVDS_L0_P, LVDS_L1_N, LVDS_L1_P, LVDS_L2_N, LVDS_L2_P, LVDS_L3_N, LVDS_L3_P, LVDS_L4_N, LVDS_L4_P, LVDS_L5_N, LVDS_L5_P, LVDS_L6_N, LVDS_L6_P, LVDS_L7_N, LVDS_L7_P

### Notes on the sheet
- (in symbol CMP-0363-00013-3, part A) BANK 13

### Library data of the parts
J5 = CMP-1241-00531-1: 0.5 mm Pitch Easy-On(TM) Type FPC Connector, 2.0 mm Mated Height, Right Angle, ZIF, SMT, Bottom Contact, 40 Circuits, -20 to 85 degC, ELV and RoHS Compliant, Tape and Reel; Manufacturer: Molex; Material - Plating Termination: Gold; Stackable: No; Pitch - Mating Interface: 0.50mm; Polarized to PCB: Yes; Material - Metal: Phosphor Bronze; Durability (mating cycles max): 20; Entry Angle: 90degrees Angle; Current (Max per Contact): 0.5A; Circuits (Loaded): 40; Mated Height: 2.00mm; Voltage (Max): 50V; PartNumber: 54132-4062; PackageReference: 54132-4062; PCB Locator: No; Orientation: Right Angle; ComponentLink3URL: http://www.molex.com/pdm_docs/sd/541324062_sd.pdf; ComponentLink3Description: Package Specification; PCB Retention: Yes; ComponentLink1Description: Manufacturer URL; Number of Rows: 1; RoHS: TRUE; Contact Position: Bottom; PackageDescription: 40-Lead FPC Connector, Pitch 0.5 mm; PackageVersion: Rev. F, 07/2010; Mounting Technology: Surface Mount; ComponentLink2Description: Datasheet; ComponentLink1URL: http://www.molex.com/molex/index.jsp; Packing: Tape and Reel; Material - Plating Mating: Gold; ComponentLink2URL: http://www.molex.com/webdocs/datasheets/pdf/en-us/0541324062_FFC_FPC_CONNECTORS.pdf
U1 = CMP-0363-00013-3: as U1 on sheet Power; ComponentLink3URL: http://www.xilinx.com/support/documentation/data_sheets/ds187-XC7Z010-XC7Z020-Data-Sheet.pdf; PackageReference: CLG484; Code_JEDEC: MO-275-PPAA-2; ComponentLink2URL: http://www.xilinx.com/support/documentation/user_guides/ug865-Zynq-7000-Pkg-Pinout.pdf; ComponentLink2Description: Package Specification; ComponentLink6URL: http://www.xilinx.com/support/documentation/user_guides/ug483_7Series_PCB.pdf; PackageVersion: Rev 1.1, 09/2012; DatasheetVersion: v1.2; PartNumber: XC7Z020-2CLG484I; ComponentLink3Description: DC and AC Switching Characteristics; PackageDescription: Wire-Bond Chip-Scale BGA, Body 19 x 19 mm, 0.8 mm Pitch; RoHS: Pb-Free; ComponentLink5URL: http://www.xilinx.com/support/documentation/user_guides/ug865-Zynq-7000-Pkg-Pinout.pdf; ComponentLink1URL: http://www.xilinx.com/support/documentation/data_sheets/ds190-Zynq-7000-Overview.pdf; ComponentLink4Description: Package File; Generic Part Number: XC7Z020; Mounting Technology: Surface Mount; ComponentLink1Description: Datasheet; ComponentLink4URL: http://www.xilinx.com/support/packagefiles/z7packages/xc7z020clg484pkg.txt; ComponentLink6Description: PCB and Layout Guide; ComponentLink5Description: Packaging and Pinout

## Sheet Bank33.SchDoc
size A3; SheetNumber: 6; SheetTotal: 9
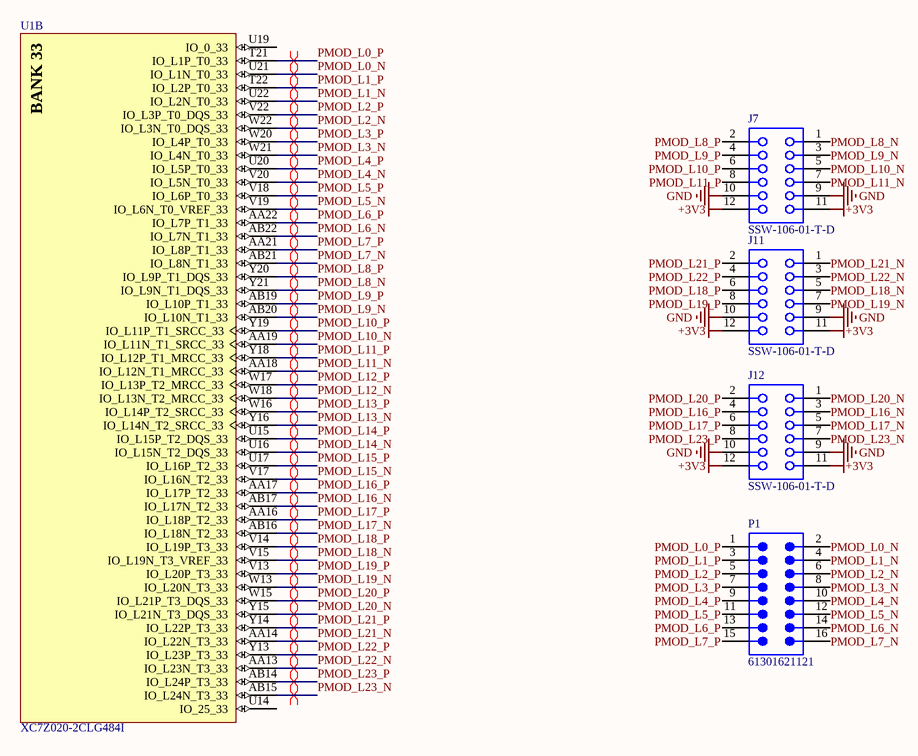
[diagram p4: Bank33.SchDoc]

### Parts
J7  SSW-106-01-T-D  [SMTC-SSW-106-01-X-D]
J11  SSW-106-01-T-D  [SMTC-SSW-106-01-X-D]
J12  SSW-106-01-T-D  [SMTC-SSW-106-01-X-D]
P1  61301621121  [61301621121]
U1  XC7Z020-2CLG484I  [CLG484]  (part B of 10)

### Nets
+3V3: J7.11 J7.12 J11.11 J11.12 J12.11 J12.12
GND: J7.9 J7.10 J11.9 J11.10 J12.9 J12.10
PMOD_L0_N: P1.2 U1.U21(IO_L1N_T0_33)
PMOD_L0_P: P1.1 U1.T21(IO_L1P_T0_33)
PMOD_L1_N: P1.4 U1.U22(IO_L2N_T0_33)
PMOD_L1_P: P1.3 U1.T22(IO_L2P_T0_33)
PMOD_L2_N: P1.6 U1.W22(IO_L3N_T0_DQS_33)
PMOD_L2_P: P1.5 U1.V22(IO_L3P_T0_DQS_33)
PMOD_L3_N: P1.8 U1.W21(IO_L4N_T0_33)
PMOD_L3_P: P1.7 U1.W20(IO_L4P_T0_33)
PMOD_L4_N: P1.10 U1.V20(IO_L5N_T0_33)
PMOD_L4_P: P1.9 U1.U20(IO_L5P_T0_33)
PMOD_L5_N: P1.12 U1.V19(IO_L6N_T0_VREF_33)
PMOD_L5_P: P1.11 U1.V18(IO_L6P_T0_33)
PMOD_L6_N: P1.14 U1.AB22(IO_L7N_T1_33)
PMOD_L6_P: P1.13 U1.AA22(IO_L7P_T1_33)
PMOD_L7_N: P1.16 U1.AB21(IO_L8N_T1_33)
PMOD_L7_P: P1.15 U1.AA21(IO_L8P_T1_33)
PMOD_L8_N: J7.1 U1.Y21(IO_L9N_T1_DQS_33)
PMOD_L8_P: J7.2 U1.Y20(IO_L9P_T1_DQS_33)
PMOD_L9_N: J7.3 U1.AB20(IO_L10N_T1_33)
PMOD_L9_P: J7.4 U1.AB19(IO_L10P_T1_33)
PMOD_L10_N: J7.5 U1.AA19(IO_L11N_T1_SRCC_33)
PMOD_L10_P: J7.6 U1.Y19(IO_L11P_T1_SRCC_33)
PMOD_L11_N: J7.7 U1.AA18(IO_L12N_T1_MRCC_33)
PMOD_L11_P: J7.8 U1.Y18(IO_L12P_T1_MRCC_33)
PMOD_L12_N: U1.W18(IO_L13N_T2_MRCC_33)
PMOD_L12_P: U1.W17(IO_L13P_T2_MRCC_33)
PMOD_L13_N: U1.Y16(IO_L14N_T2_SRCC_33)
PMOD_L13_P: U1.W16(IO_L14P_T2_SRCC_33)
PMOD_L14_N: U1.U16(IO_L15N_T2_DQS_33)
PMOD_L14_P: U1.U15(IO_L15P_T2_DQS_33)
PMOD_L15_N: U1.V17(IO_L16N_T2_33)
PMOD_L15_P: U1.U17(IO_L16P_T2_33)
PMOD_L16_N: J12.3 U1.AB17(IO_L17N_T2_33)
PMOD_L16_P: J12.4 U1.AA17(IO_L17P_T2_33)
PMOD_L17_N: J12.5 U1.AB16(IO_L18N_T2_33)
PMOD_L17_P: J12.6 U1.AA16(IO_L18P_T2_33)
PMOD_L18_N: J11.5 U1.V15(IO_L19N_T3_VREF_33)
PMOD_L18_P: J11.6 U1.V14(IO_L19P_T3_33)
PMOD_L19_N: J11.7 U1.W13(IO_L20N_T3_33)
PMOD_L19_P: J11.8 U1.V13(IO_L20P_T3_33)
PMOD_L20_N: J12.1 U1.Y15(IO_L21N_T3_DQS_33)
PMOD_L20_P: J12.2 U1.W15(IO_L21P_T3_DQS_33)
PMOD_L21_N: J11.1 U1.AA14(IO_L22N_T3_33)
PMOD_L21_P: J11.2 U1.Y14(IO_L22P_T3_33)
PMOD_L22_N: J11.3 U1.AA13(IO_L23N_T3_33)
PMOD_L22_P: J11.4 U1.Y13(IO_L23P_T3_33)
PMOD_L23_N: J12.7 U1.AB15(IO_L24N_T3_33)
PMOD_L23_P: J12.8 U1.AB14(IO_L24P_T3_33)

Not connected (* = marked no-connect by the designer): U1 U14(IO_25_33) U19(IO_0_33)

### Layout directives
differential pair: PMOD_L0_N, PMOD_L0_P, PMOD_L1_N, PMOD_L1_P, PMOD_L2_N, PMOD_L2_P, PMOD_L3_N, PMOD_L3_P, PMOD_L4_N, PMOD_L4_P, PMOD_L5_N, PMOD_L5_P, PMOD_L6_N, PMOD_L6_P, PMOD_L7_N, PMOD_L7_P, PMOD_L8_N, PMOD_L8_P, PMOD_L9_N, PMOD_L9_P, PMOD_L10_N, PMOD_L10_P, PMOD_L11_N, PMOD_L11_P, PMOD_L12_N, PMOD_L12_P, PMOD_L13_N, PMOD_L13_P, PMOD_L14_N, PMOD_L14_P, PMOD_L15_N, PMOD_L15_P, PMOD_L16_N, PMOD_L16_P, PMOD_L17_N, PMOD_L17_P, PMOD_L18_N, PMOD_L18_P, PMOD_L19_N, PMOD_L19_P, PMOD_L20_N, PMOD_L20_P, PMOD_L21_N, PMOD_L21_P, PMOD_L22_N, PMOD_L22_P, PMOD_L23_N, PMOD_L23_P

### Notes on the sheet
- (in symbol CMP-0363-00013-3, part B) BANK 33

### Library data of the parts
J7 J11 J12 = CMP-1023-00356-1: SQ Post Socket, Through-hole, Vertical, -55 to 105 degC, 2.54mm Pitch, 12-Pin, Female, RoHS; Manufacturer: Samtec; ComponentLink1Description: Manufacturer URL; RoHS: True; Mounting Technology: Through-hole; ComponentLink1URL: http://www.samtec.com; PackageVersion: CA, 6/1987; DatasheetVersion: F-214; PackageReference: SSW-106-01-X-D; Temperature Range: -55 to 105 degC; PartNumber: SSW-106-01-T-D; ComponentLink3URL: http://www.samtec.com/documents/webfiles/cpdf/SSW-1XX-XX-XXX-X-XX-XXX-XX-MKT.pdf; ComponentLink2URL: http://www.samtec.com/documents/webfiles/pdf/SSW_TH.PDF; Pitch: 2.54 mm; Orientation: Vertical; ComponentLink3Description: Package Specification; ComponentLink2Description: Datasheet; PackageDescription: Assembly, Socket Strip .016 X .031 Tail
P1 = CMP-1502-01097-2
U1 = CMP-0363-00013-3: as U1 on sheet Power; ComponentLink3URL: http://www.xilinx.com/support/documentation/data_sheets/ds187-XC7Z010-XC7Z020-Data-Sheet.pdf; PackageReference: CLG484; Code_JEDEC: MO-275-PPAA-2; ComponentLink2URL: http://www.xilinx.com/support/documentation/user_guides/ug865-Zynq-7000-Pkg-Pinout.pdf; ComponentLink2Description: Package Specification; ComponentLink6URL: http://www.xilinx.com/support/documentation/user_guides/ug483_7Series_PCB.pdf; PackageVersion: Rev 1.1, 09/2012; DatasheetVersion: v1.2; PartNumber: XC7Z020-2CLG484I; ComponentLink3Description: DC and AC Switching Characteristics; PackageDescription: Wire-Bond Chip-Scale BGA, Body 19 x 19 mm, 0.8 mm Pitch; RoHS: Pb-Free; ComponentLink5URL: http://www.xilinx.com/support/documentation/user_guides/ug865-Zynq-7000-Pkg-Pinout.pdf; ComponentLink1URL: http://www.xilinx.com/support/documentation/data_sheets/ds190-Zynq-7000-Overview.pdf; ComponentLink4Description: Package File; Generic Part Number: XC7Z020; Mounting Technology: Surface Mount; ComponentLink1Description: Datasheet; ComponentLink4URL: http://www.xilinx.com/support/packagefiles/z7packages/xc7z020clg484pkg.txt; ComponentLink6Description: PCB and Layout Guide; ComponentLink5Description: Packaging and Pinout

## Sheet Bank34.SchDoc
size A3; SheetNumber: 7; SheetTotal: 9
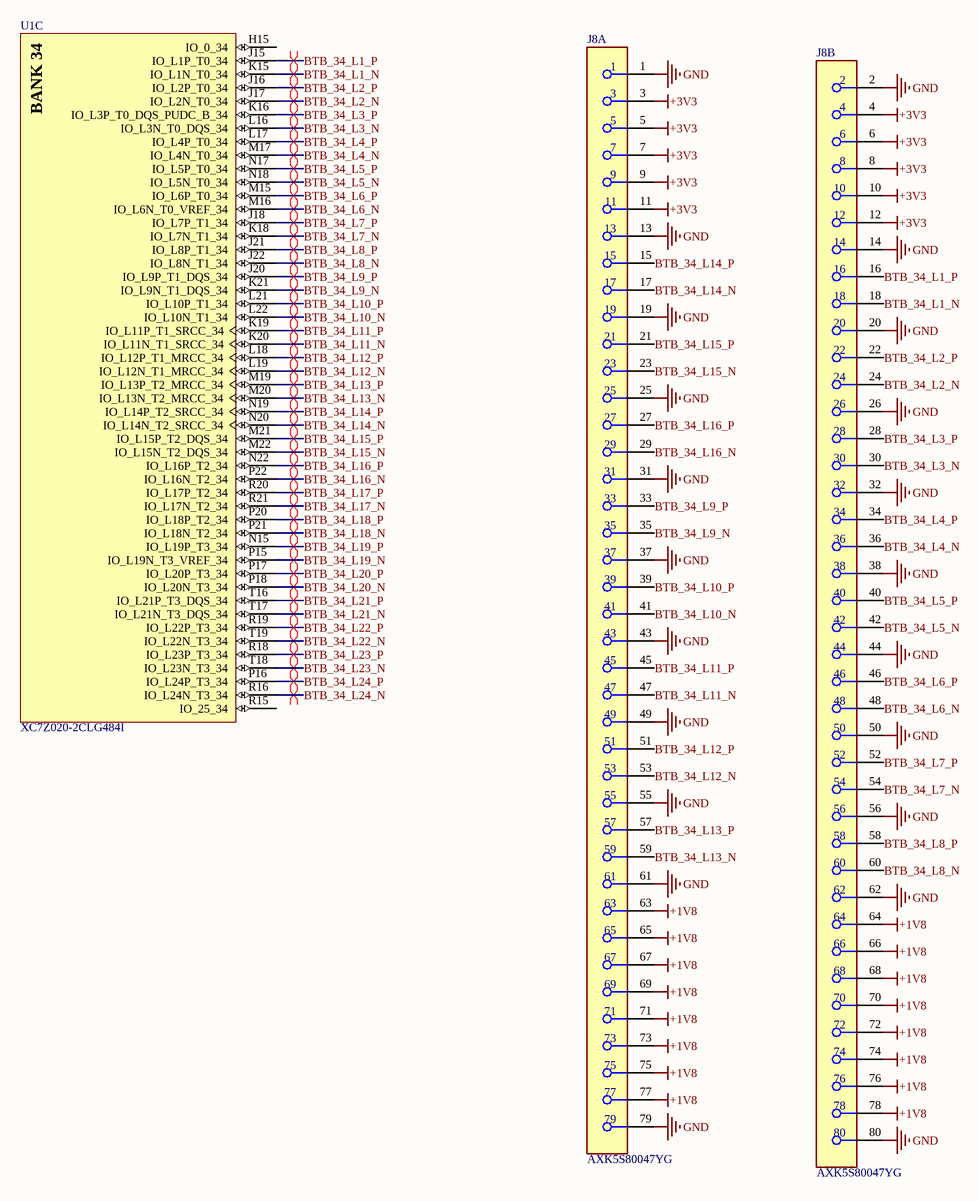
[diagram p5: Bank34.SchDoc]

### Parts
J8  AXK5S80047YG  [FP-AXK5S80047YG-MFG]  (parts A,B of 2)
U1  XC7Z020-2CLG484I  [CLG484]  (part C of 10)

### Nets
+1V8: J8.63 J8.64 J8.65 J8.66 J8.67 J8.68 J8.69 J8.70 J8.71 J8.72 J8.73 J8.74 J8.75 J8.76 J8.77 J8.78
+3V3: J8.3 J8.4 J8.5 J8.6 J8.7 J8.8 J8.9 J8.10 J8.11 J8.12
GND: J8.1 J8.2 J8.13 J8.14 J8.19 J8.20 J8.25 J8.26 J8.31 J8.32 J8.37 J8.38 J8.43 J8.44 J8.49 J8.50 J8.55 J8.56 J8.61 J8.62 J8.79 J8.80
BTB_34_L1_N: J8.18 U1.K15(IO_L1N_T0_34)
BTB_34_L1_P: J8.16 U1.J15(IO_L1P_T0_34)
BTB_34_L2_N: J8.24 U1.J17(IO_L2N_T0_34)
BTB_34_L2_P: J8.22 U1.J16(IO_L2P_T0_34)
BTB_34_L3_N: J8.30 U1.L16(IO_L3N_T0_DQS_34)
BTB_34_L3_P: J8.28 U1.K16(IO_L3P_T0_DQS_PUDC_B_34)
BTB_34_L4_N: J8.36 U1.M17(IO_L4N_T0_34)
BTB_34_L4_P: J8.34 U1.L17(IO_L4P_T0_34)
BTB_34_L5_N: J8.42 U1.N18(IO_L5N_T0_34)
BTB_34_L5_P: J8.40 U1.N17(IO_L5P_T0_34)
BTB_34_L6_N: J8.48 U1.M16(IO_L6N_T0_VREF_34)
BTB_34_L6_P: J8.46 U1.M15(IO_L6P_T0_34)
BTB_34_L7_N: J8.54 U1.K18(IO_L7N_T1_34)
BTB_34_L7_P: J8.52 U1.J18(IO_L7P_T1_34)
BTB_34_L8_N: J8.60 U1.J22(IO_L8N_T1_34)
BTB_34_L8_P: J8.58 U1.J21(IO_L8P_T1_34)
BTB_34_L9_N: J8.35 U1.K21(IO_L9N_T1_DQS_34)
BTB_34_L9_P: J8.33 U1.J20(IO_L9P_T1_DQS_34)
BTB_34_L10_N: J8.41 U1.L22(IO_L10N_T1_34)
BTB_34_L10_P: J8.39 U1.L21(IO_L10P_T1_34)
BTB_34_L11_N: J8.47 U1.K20(IO_L11N_T1_SRCC_34)
BTB_34_L11_P: J8.45 U1.K19(IO_L11P_T1_SRCC_34)
BTB_34_L12_N: J8.53 U1.L19(IO_L12N_T1_MRCC_34)
BTB_34_L12_P: J8.51 U1.L18(IO_L12P_T1_MRCC_34)
BTB_34_L13_N: J8.59 U1.M20(IO_L13N_T2_MRCC_34)
BTB_34_L13_P: J8.57 U1.M19(IO_L13P_T2_MRCC_34)
BTB_34_L14_N: J8.17 U1.N20(IO_L14N_T2_SRCC_34)
BTB_34_L14_P: J8.15 U1.N19(IO_L14P_T2_SRCC_34)
BTB_34_L15_N: J8.23 U1.M22(IO_L15N_T2_DQS_34)
BTB_34_L15_P: J8.21 U1.M21(IO_L15P_T2_DQS_34)
BTB_34_L16_N: J8.29 U1.P22(IO_L16N_T2_34)
BTB_34_L16_P: J8.27 U1.N22(IO_L16P_T2_34)
BTB_34_L17_N: U1.R21(IO_L17N_T2_34)
BTB_34_L17_P: U1.R20(IO_L17P_T2_34)
BTB_34_L18_N: U1.P21(IO_L18N_T2_34)
BTB_34_L18_P: U1.P20(IO_L18P_T2_34)
BTB_34_L19_N: U1.P15(IO_L19N_T3_VREF_34)
BTB_34_L19_P: U1.N15(IO_L19P_T3_34)
BTB_34_L20_N: U1.P18(IO_L20N_T3_34)
BTB_34_L20_P: U1.P17(IO_L20P_T3_34)
BTB_34_L21_N: U1.T17(IO_L21N_T3_DQS_34)
BTB_34_L21_P: U1.T16(IO_L21P_T3_DQS_34)
BTB_34_L22_N: U1.T19(IO_L22N_T3_34)
BTB_34_L22_P: U1.R19(IO_L22P_T3_34)
BTB_34_L23_N: U1.T18(IO_L23N_T3_34)
BTB_34_L23_P: U1.R18(IO_L23P_T3_34)
BTB_34_L24_N: U1.R16(IO_L24N_T3_34)
BTB_34_L24_P: U1.P16(IO_L24P_T3_34)

Not connected (* = marked no-connect by the designer): U1 H15(IO_0_34) R15(IO_25_34)

### Layout directives
differential pair: BTB_34_L1_N, BTB_34_L1_P, BTB_34_L2_N, BTB_34_L2_P, BTB_34_L3_N, BTB_34_L3_P, BTB_34_L4_N, BTB_34_L4_P, BTB_34_L5_N, BTB_34_L5_P, BTB_34_L6_N, BTB_34_L6_P, BTB_34_L7_N, BTB_34_L7_P, BTB_34_L8_N, BTB_34_L8_P, BTB_34_L9_N, BTB_34_L9_P, BTB_34_L10_N, BTB_34_L10_P, BTB_34_L11_N, BTB_34_L11_P, BTB_34_L12_N, BTB_34_L12_P, BTB_34_L13_N, BTB_34_L13_P, BTB_34_L14_N, BTB_34_L14_P, BTB_34_L15_N, BTB_34_L15_P, BTB_34_L16_N, BTB_34_L16_P, BTB_34_L17_N, BTB_34_L17_P, BTB_34_L18_N, BTB_34_L18_P, BTB_34_L19_N, BTB_34_L19_P, BTB_34_L20_N, BTB_34_L20_P, BTB_34_L21_N, BTB_34_L21_P, BTB_34_L22_N, BTB_34_L22_P, BTB_34_L23_N, BTB_34_L23_P, BTB_34_L24_N, BTB_34_L24_P

### Notes on the sheet
- (in symbol CMP-0363-00013-3, part C) BANK 34

### Library data of the parts
J8 = CMP-05580-000001-1: CONN SOCKET BRD/BRD .5MM 80POS; Manufacturer: Panasonic; Is Female: yes; Current Rating: 0.5A; Voltage Rating: 60V; Conn Orientation: Vertical; Number Of Contacts: 80; Conn Gender: Female; Pitch: 0.5mm; Octopart: https://octopart.com/axk5s80047yg-panasonic-7879921; Device Class L1: Connectors; ComponentLink2Description: Datasheet; Ambient Temperature Range Low: -55°C; Package: AXK5S80047YG; Height: 3.25mm; Number Of Rows: 2; Device Class L3: unset; Lead Free: Yes; Category: Conn; Contact Material: Gold,Nickel; Device Class L2: Headers and Wire Housings; Mouser Description: Board to Board & Mezzanine Connectors CONN SOCKET BRD/BRD 80 POS 0.5mm; Ambient Temperature Range High: +85°C; ComponentLink2URL: https://www3.panasonic.biz/ac/e_download/control/connector/base-base/catalog/con_eng_p5k.pdf; Automotive: No; RoHS: TRUE; Digikey Description: CONN SOCKET BRD/BRD .5MM 80POS; Manufacturer Part Number: AXK5S80047YG
U1 = CMP-0363-00013-3: as U1 on sheet Power; ComponentLink3URL: http://www.xilinx.com/support/documentation/data_sheets/ds187-XC7Z010-XC7Z020-Data-Sheet.pdf; PackageReference: CLG484; Code_JEDEC: MO-275-PPAA-2; ComponentLink2URL: http://www.xilinx.com/support/documentation/user_guides/ug865-Zynq-7000-Pkg-Pinout.pdf; ComponentLink2Description: Package Specification; ComponentLink6URL: http://www.xilinx.com/support/documentation/user_guides/ug483_7Series_PCB.pdf; PackageVersion: Rev 1.1, 09/2012; DatasheetVersion: v1.2; PartNumber: XC7Z020-2CLG484I; ComponentLink3Description: DC and AC Switching Characteristics; PackageDescription: Wire-Bond Chip-Scale BGA, Body 19 x 19 mm, 0.8 mm Pitch; RoHS: Pb-Free; ComponentLink5URL: http://www.xilinx.com/support/documentation/user_guides/ug865-Zynq-7000-Pkg-Pinout.pdf; ComponentLink1URL: http://www.xilinx.com/support/documentation/data_sheets/ds190-Zynq-7000-Overview.pdf; ComponentLink4Description: Package File; Generic Part Number: XC7Z020; Mounting Technology: Surface Mount; ComponentLink1Description: Datasheet; ComponentLink4URL: http://www.xilinx.com/support/packagefiles/z7packages/xc7z020clg484pkg.txt; ComponentLink6Description: PCB and Layout Guide; ComponentLink5Description: Packaging and Pinout

## Sheet Bank35.SchDoc
size A3; SheetNumber: 8; SheetTotal: 9
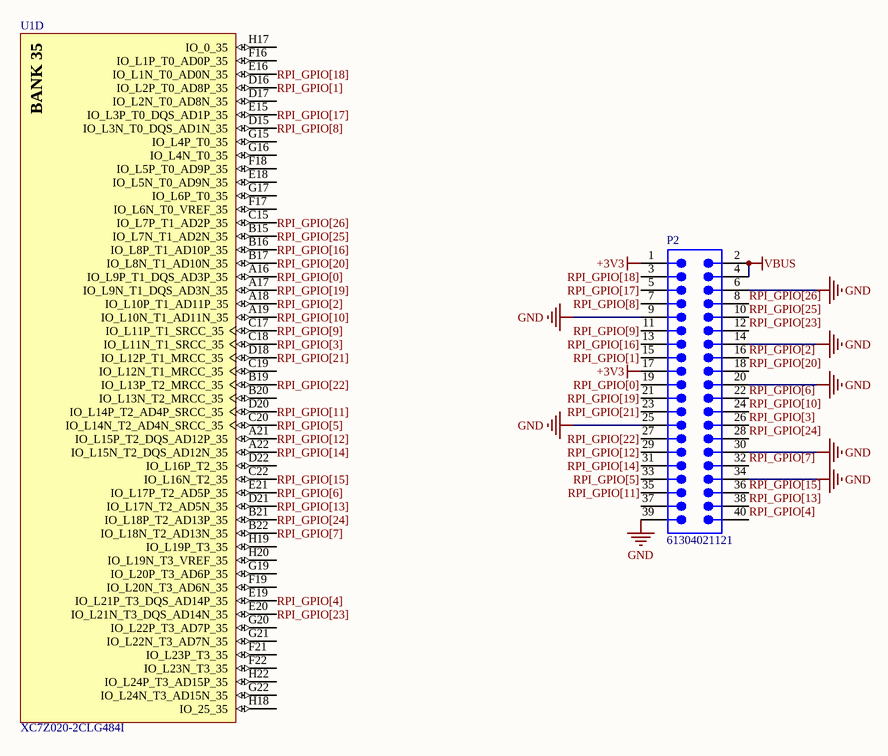
[diagram p6: Bank35.SchDoc]

### Parts
P2  61304021121  [61304021121]
U1  XC7Z020-2CLG484I  [CLG484]  (part D of 10)

### Nets
+3V3: P2.1 P2.17
GND: P2.6 P2.9 P2.14 P2.20 P2.25 P2.30 P2.34 P2.39
VBUS: P2.2 P2.4
RPI_GPIO[0]: P2.19 U1.A16(IO_L9P_T1_DQS_AD3P_35)
RPI_GPIO[1]: P2.15 U1.D16(IO_L2P_T0_AD8P_35)
RPI_GPIO[2]: P2.16 U1.A18(IO_L10P_T1_AD11P_35)
RPI_GPIO[3]: P2.26 U1.C18(IO_L11N_T1_SRCC_35)
RPI_GPIO[4]: P2.40 U1.E19(IO_L21P_T3_DQS_AD14P_35)
RPI_GPIO[5]: P2.33 U1.C20(IO_L14N_T2_AD4N_SRCC_35)
RPI_GPIO[6]: P2.22 U1.E21(IO_L17P_T2_AD5P_35)
RPI_GPIO[7]: P2.32 U1.B22(IO_L18N_T2_AD13N_35)
RPI_GPIO[8]: P2.7 U1.D15(IO_L3N_T0_DQS_AD1N_35)
RPI_GPIO[9]: P2.11 U1.C17(IO_L11P_T1_SRCC_35)
RPI_GPIO[10]: P2.24 U1.A19(IO_L10N_T1_AD11N_35)
RPI_GPIO[11]: P2.35 U1.D20(IO_L14P_T2_AD4P_SRCC_35)
RPI_GPIO[12]: P2.29 U1.A21(IO_L15P_T2_DQS_AD12P_35)
RPI_GPIO[13]: P2.38 U1.D21(IO_L17N_T2_AD5N_35)
RPI_GPIO[14]: P2.31 U1.A22(IO_L15N_T2_DQS_AD12N_35)
RPI_GPIO[15]: P2.36 U1.C22(IO_L16N_T2_35)
RPI_GPIO[16]: P2.13 U1.B16(IO_L8P_T1_AD10P_35)
RPI_GPIO[17]: P2.5 U1.E15(IO_L3P_T0_DQS_AD1P_35)
RPI_GPIO[18]: P2.3 U1.E16(IO_L1N_T0_AD0N_35)
RPI_GPIO[19]: P2.21 U1.A17(IO_L9N_T1_DQS_AD3N_35)
RPI_GPIO[20]: P2.18 U1.B17(IO_L8N_T1_AD10N_35)
RPI_GPIO[21]: P2.23 U1.D18(IO_L12P_T1_MRCC_35)
RPI_GPIO[22]: P2.27 U1.B19(IO_L13P_T2_MRCC_35)
RPI_GPIO[23]: P2.12 U1.E20(IO_L21N_T3_DQS_AD14N_35)
RPI_GPIO[24]: P2.28 U1.B21(IO_L18P_T2_AD13P_35)
RPI_GPIO[25]: P2.10 U1.B15(IO_L7N_T1_AD2N_35)
RPI_GPIO[26]: P2.8 U1.C15(IO_L7P_T1_AD2P_35)

Not connected (* = marked no-connect by the designer): P2 37; U1 B20(IO_L13N_T2_MRCC_35) C19(IO_L12N_T1_MRCC_35) D17(IO_L2N_T0_AD8N_35) D22(IO_L16P_T2_35) E18(IO_L5N_T0_AD9N_35) F16(IO_L1P_T0_AD0P_35) F17(IO_L6N_T0_VREF_35) F18(IO_L5P_T0_AD9P_35) F19(IO_L20N_T3_AD6N_35) F21(IO_L23P_T3_35) F22(IO_L23N_T3_35) G15(IO_L4P_T0_35) G16(IO_L4N_T0_35) G17(IO_L6P_T0_35) G19(IO_L20P_T3_AD6P_35) G20(IO_L22P_T3_AD7P_35) G21(IO_L22N_T3_AD7N_35) G22(IO_L24N_T3_AD15N_35) H17(IO_0_35) H18(IO_25_35) H19(IO_L19P_T3_35) H20(IO_L19N_T3_VREF_35) H22(IO_L24P_T3_AD15P_35)

### Notes on the sheet
- (in symbol CMP-0363-00013-3, part D) BANK 35

### Library data of the parts
P2 = CMP-1502-01135-2
U1 = CMP-0363-00013-3: as U1 on sheet Power; ComponentLink3URL: http://www.xilinx.com/support/documentation/data_sheets/ds187-XC7Z010-XC7Z020-Data-Sheet.pdf; PackageReference: CLG484; Code_JEDEC: MO-275-PPAA-2; ComponentLink2URL: http://www.xilinx.com/support/documentation/user_guides/ug865-Zynq-7000-Pkg-Pinout.pdf; ComponentLink2Description: Package Specification; ComponentLink6URL: http://www.xilinx.com/support/documentation/user_guides/ug483_7Series_PCB.pdf; PackageVersion: Rev 1.1, 09/2012; DatasheetVersion: v1.2; PartNumber: XC7Z020-2CLG484I; ComponentLink3Description: DC and AC Switching Characteristics; PackageDescription: Wire-Bond Chip-Scale BGA, Body 19 x 19 mm, 0.8 mm Pitch; RoHS: Pb-Free; ComponentLink5URL: http://www.xilinx.com/support/documentation/user_guides/ug865-Zynq-7000-Pkg-Pinout.pdf; ComponentLink1URL: http://www.xilinx.com/support/documentation/data_sheets/ds190-Zynq-7000-Overview.pdf; ComponentLink4Description: Package File; Generic Part Number: XC7Z020; Mounting Technology: Surface Mount; ComponentLink1Description: Datasheet; ComponentLink4URL: http://www.xilinx.com/support/packagefiles/z7packages/xc7z020clg484pkg.txt; ComponentLink6Description: PCB and Layout Guide; ComponentLink5Description: Packaging and Pinout